# Altium project RobonAUT_Project.PrjPcb
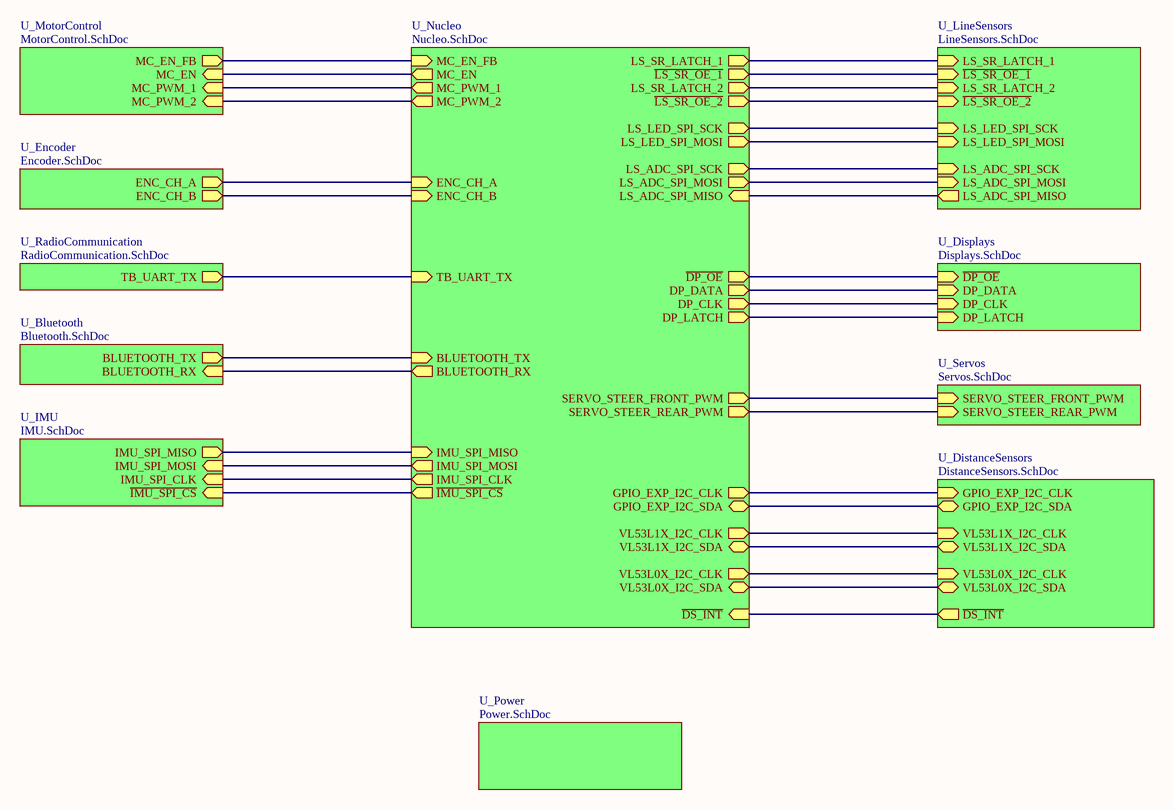
[diagram p0: TopLevel.SchDoc]
14 sheets, 120 parts. Net scope: hierarchical (ports join the sheet entries above them; power ports are global).
Board file: LKBulls2023.PcbDoc
Sheets:
  TopLevel.SchDoc
    U_Nucleo = Nucleo.SchDoc
    U_LineSensors = LineSensors.SchDoc
    U_Displays = Displays.SchDoc
    U_Power = Power.SchDoc
    U_Servos = Servos.SchDoc
    U_DistanceSensors = DistanceSensors.SchDoc
      DS1 = VL53L1X-SATEL.SchDoc
      DS2 = VL53L1X-SATEL.SchDoc
      DS3 = VL53L1X-SATEL.SchDoc
      DS4 = VL53L1X-SATEL.SchDoc
      DS5 = 53L0-SATEL-I1.SchDoc
      DS6 = 53L0-SATEL-I1.SchDoc
      DS7 = 53L0-SATEL-I1.SchDoc
      DS8 = 53L0-SATEL-I1.SchDoc
    U_MotorControl = MotorControl.SchDoc
    U_Encoder = Encoder.SchDoc
    U_RadioCommunication = RadioCommunication.SchDoc
    U_Bluetooth = Bluetooth.SchDoc
    U_IMU = IMU.SchDoc

## Sheet TopLevel.SchDoc: Top Level - Hierarchical View
size A4; Date: 2022 Fall; Address1: LK Bulls; Address2: Bagoly Zoltan; Address3: Feher Daniel; Address4: G. Varga Gabor; DocumentNumber: 1; Revision: 1.0; SheetNumber: 1; SheetTotal: 14

### Sub-sheets
U_Bluetooth = Bluetooth.SchDoc: BLUETOOTH_TX (out), BLUETOOTH_RX (in)
U_Displays = Displays.SchDoc: ~{DP_OE} (in), DP_DATA (in), DP_CLK (in), DP_LATCH (in)
U_DistanceSensors = DistanceSensors.SchDoc: ~{DS_INT} (out), VL53L1X_I2C_CLK (in), VL53L1X_I2C_SDA (bidir), VL53L0X_I2C_CLK (in), VL53L0X_I2C_SDA (bidir), GPIO_EXP_I2C_CLK (in), GPIO_EXP_I2C_SDA (bidir)
U_Encoder = Encoder.SchDoc: ENC_CH_B (out), ENC_CH_A (out)
U_IMU = IMU.SchDoc: IMU_SPI_MISO (out), IMU_SPI_MOSI (in), IMU_SPI_CLK (in), ~{IMU_SPI_CS} (in)
U_LineSensors = LineSensors.SchDoc: LS_LED_SPI_MOSI (in), ~{LS_SR_OE_1} (in), LS_SR_LATCH_1 (in), LS_LED_SPI_SCK (in), LS_SR_LATCH_2 (in), LS_ADC_SPI_MOSI (in), LS_ADC_SPI_MISO (out), LS_ADC_SPI_SCK (in), ~{LS_SR_OE_2} (in)
U_MotorControl = MotorControl.SchDoc: MC_EN_FB (out), MC_EN (in), MC_PWM_1 (in), MC_PWM_2 (in)
U_Nucleo = Nucleo.SchDoc: LS_SR_LATCH_1 (out), LS_SR_LATCH_2 (out), DP_DATA (out), DP_CLK (out), DP_LATCH (out), TB_UART_TX (in), ENC_CH_B (in), ENC_CH_A (in), MC_EN_FB (in), MC_EN (out), MC_PWM_1 (out), MC_PWM_2 (out), SERVO_STEER_FRONT_PWM (out), SERVO_STEER_REAR_PWM (out), BLUETOOTH_TX (in), BLUETOOTH_RX (out), IMU_SPI_MISO (in), IMU_SPI_MOSI (out), IMU_SPI_CLK (out), LS_LED_SPI_MOSI (out), LS_LED_SPI_SCK (out), LS_ADC_SPI_MOSI (out), LS_ADC_SPI_MISO (in), LS_ADC_SPI_SCK (out), ~{IMU_SPI_CS} (out), ~{DP_OE} (out), ~{LS_SR_OE_1} (out), ~{LS_SR_OE_2} (out), ~{DS_INT} (in), VL53L1X_I2C_CLK (out), VL53L1X_I2C_SDA (bidir), VL53L0X_I2C_CLK (out), VL53L0X_I2C_SDA (bidir), GPIO_EXP_I2C_CLK (out), GPIO_EXP_I2C_SDA (bidir)
U_Power = Power.SchDoc: no entries
U_RadioCommunication = RadioCommunication.SchDoc: TB_UART_TX (out)
U_Servos = Servos.SchDoc: SERVO_STEER_FRONT_PWM (in), SERVO_STEER_REAR_PWM (in)

### Nets
NetCN6_DS1_2: sheet U_Nucleo/VL53L1X_I2C_CLK, sheet U_DistanceSensors/VL53L1X_I2C_CLK
NetCN6_DS1_4: sheet U_Nucleo/VL53L1X_I2C_SDA, sheet U_DistanceSensors/VL53L1X_I2C_SDA
NetCN7_DS5_2: sheet U_Nucleo/VL53L0X_I2C_CLK, sheet U_DistanceSensors/VL53L0X_I2C_CLK
NetCN7_DS5_4: sheet U_Nucleo/VL53L0X_I2C_SDA, sheet U_DistanceSensors/VL53L0X_I2C_SDA
NetCN12_4: sheet U_Nucleo/BLUETOOTH_RX, sheet U_Bluetooth/BLUETOOTH_RX
NetR3_2: sheet U_Nucleo/LS_LED_SPI_MOSI, sheet U_LineSensors/LS_LED_SPI_MOSI
NetR4_2: sheet U_Nucleo/LS_LED_SPI_SCK, sheet U_LineSensors/LS_LED_SPI_SCK
NetR5_2: sheet U_Nucleo/LS_ADC_SPI_MOSI, sheet U_LineSensors/LS_ADC_SPI_MOSI
NetR6_2: sheet U_Nucleo/LS_ADC_SPI_MISO, sheet U_LineSensors/LS_ADC_SPI_MISO
NetR7_2: sheet U_Nucleo/LS_ADC_SPI_SCK, sheet U_LineSensors/LS_ADC_SPI_SCK
NetR8_1: sheet U_Nucleo/~{LS_SR_OE_1}, sheet U_LineSensors/~{LS_SR_OE_1}
NetR9_1: sheet U_Nucleo/~{LS_SR_OE_2}, sheet U_LineSensors/~{LS_SR_OE_2}
NetR10_1: sheet U_Nucleo/~{DP_OE}, sheet U_Displays/~{DP_OE}
NetR18_1: sheet U_Nucleo/SERVO_STEER_FRONT_PWM, sheet U_Servos/SERVO_STEER_FRONT_PWM
NetR19_1: sheet U_Nucleo/SERVO_STEER_REAR_PWM, sheet U_Servos/SERVO_STEER_REAR_PWM
NetR20_1: sheet U_Nucleo/GPIO_EXP_I2C_SDA, sheet U_DistanceSensors/GPIO_EXP_I2C_SDA
NetR21_1: sheet U_Nucleo/GPIO_EXP_I2C_CLK, sheet U_DistanceSensors/GPIO_EXP_I2C_CLK
NetR26_1: sheet U_Nucleo/~{DS_INT}, sheet U_DistanceSensors/~{DS_INT}
NetR35_1: sheet U_Nucleo/MC_EN_FB, sheet U_MotorControl/MC_EN_FB
NetR36_1: sheet U_Nucleo/MC_EN, sheet U_MotorControl/MC_EN
NetR37_1: sheet U_Nucleo/MC_PWM_1, sheet U_MotorControl/MC_PWM_1
NetR38_1: sheet U_Nucleo/MC_PWM_2, sheet U_MotorControl/MC_PWM_2
NetR39_1: sheet U_Nucleo/ENC_CH_B, sheet U_Encoder/ENC_CH_B
NetR40_1: sheet U_Nucleo/ENC_CH_A, sheet U_Encoder/ENC_CH_A
NetR41_2: sheet U_Nucleo/TB_UART_TX, sheet U_RadioCommunication/TB_UART_TX
NetR42_1: sheet U_Nucleo/BLUETOOTH_TX, sheet U_Bluetooth/BLUETOOTH_TX
NetR43_2: sheet U_Nucleo/IMU_SPI_MISO, sheet U_IMU/IMU_SPI_MISO
NetU1_1: sheet U_Nucleo/IMU_SPI_CLK, sheet U_IMU/IMU_SPI_CLK
NetU1_17: sheet U_Nucleo/~{IMU_SPI_CS}, sheet U_IMU/~{IMU_SPI_CS}
NetU1_30: sheet U_Nucleo/DP_DATA, sheet U_Displays/DP_DATA
NetU1_34: sheet U_Nucleo/IMU_SPI_MOSI, sheet U_IMU/IMU_SPI_MOSI
NetU1_35: sheet U_Nucleo/DP_LATCH, sheet U_Displays/DP_LATCH
NetU1_37: sheet U_Nucleo/DP_CLK, sheet U_Displays/DP_CLK
NetU1_62: sheet U_Nucleo/LS_SR_LATCH_2, sheet U_LineSensors/LS_SR_LATCH_2
NetU1_72: sheet U_Nucleo/LS_SR_LATCH_1, sheet U_LineSensors/LS_SR_LATCH_1

### Notes on the sheet
- Title
- Size:
- Date:
- A4
- Number:
- Revision:
- Sheet
- of
- Designed by:
- File:

## Sheet Nucleo.SchDoc: Nucleo
size A4; Date: 2022 Fall; Address1: LK Bulls; Address2: Bagoly Zoltan; Address3: Feher Daniel; Address4: G. Varga Gabor; DocumentNumber: 2; Revision: 1.0; SheetNumber: 2; SheetTotal: 14
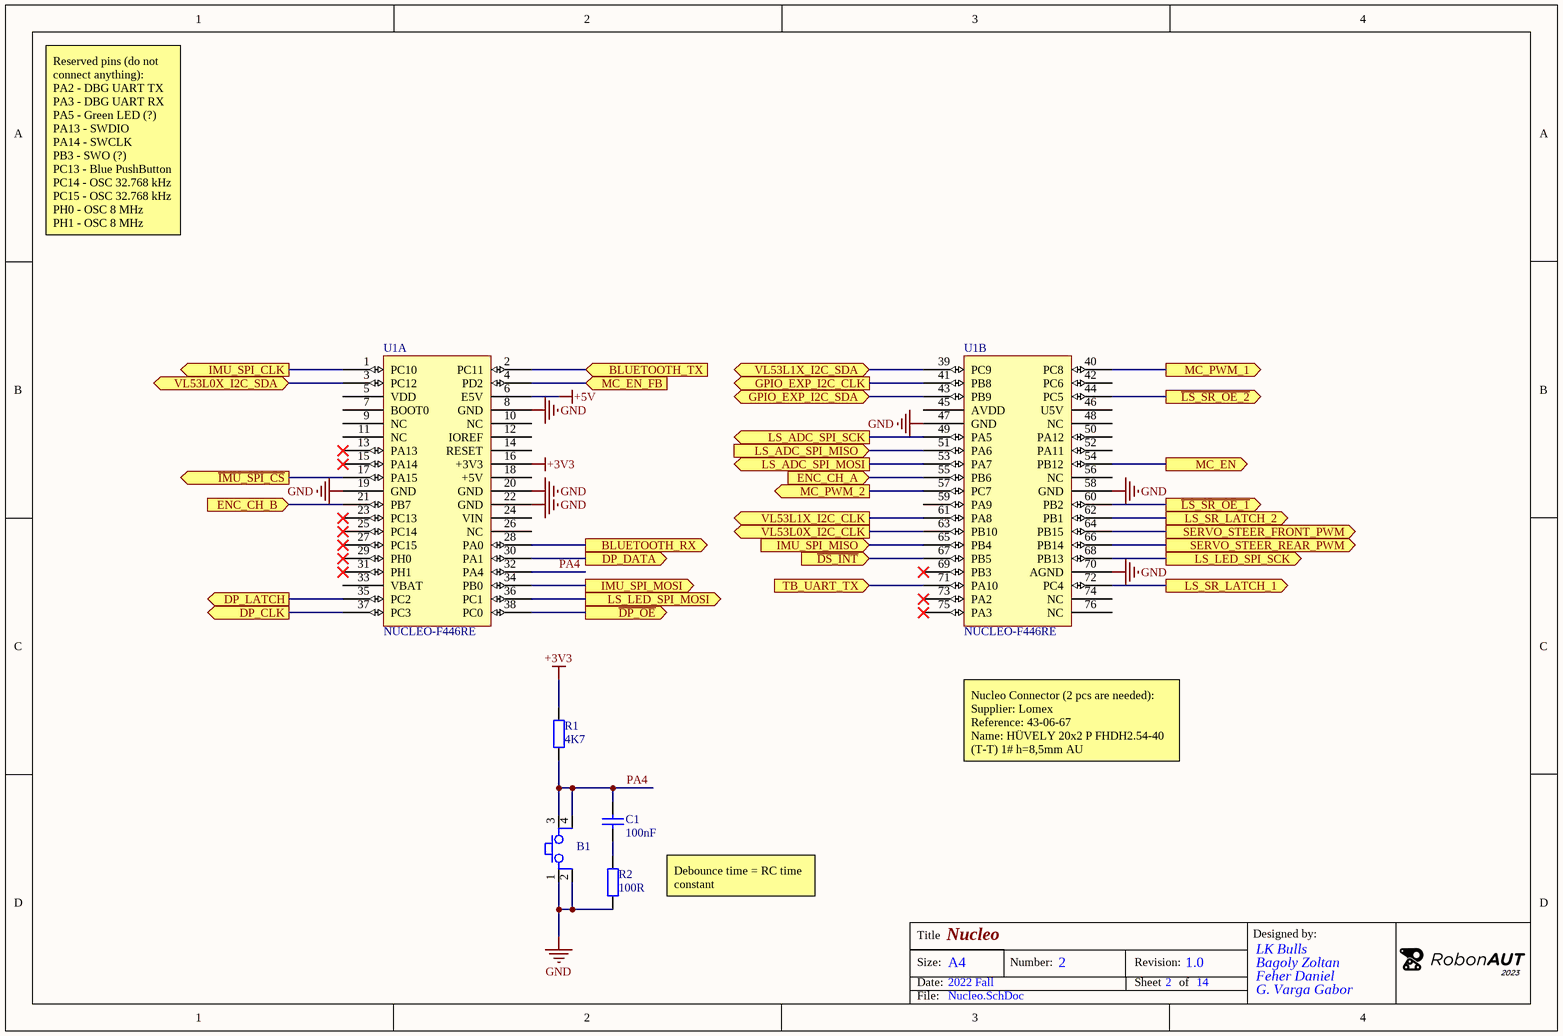
[diagram p1: Nucleo.SchDoc]

### Parts
B1  Button  [FP_BTN_SMD]  (value not drawn)
C1  100nF  [FP_0805_CAP_085]
R1  4K7  [FP_0805_RES]
R2  100R  [FP_0805_RES]
U1  NUCLEO-F446RE  [FP_NUCLEO-64]  (parts A,B of 2)

### Ports
BLUETOOTH_RX (out), BLUETOOTH_TX (in), DP_CLK (out), DP_DATA (out), DP_LATCH (out), ENC_CH_A (in), ENC_CH_B (in), GPIO_EXP_I2C_CLK (out), GPIO_EXP_I2C_SDA (bidir), IMU_SPI_CLK (out), IMU_SPI_MISO (in), IMU_SPI_MOSI (out), LS_ADC_SPI_MISO (in), LS_ADC_SPI_MOSI (out), LS_ADC_SPI_SCK (out), LS_LED_SPI_MOSI (out), LS_LED_SPI_SCK (out), LS_SR_LATCH_1 (out), LS_SR_LATCH_2 (out), MC_EN (out), MC_EN_FB (in), MC_PWM_1 (out), MC_PWM_2 (out), SERVO_STEER_FRONT_PWM (out), SERVO_STEER_REAR_PWM (out), TB_UART_TX (in), VL53L0X_I2C_CLK (out), VL53L0X_I2C_SDA (bidir), VL53L1X_I2C_CLK (out), VL53L1X_I2C_SDA (bidir), ~{DP_OE} (out), ~{DS_INT} (in), ~{IMU_SPI_CS} (out), ~{LS_SR_OE_1} (out), ~{LS_SR_OE_2} (out)

### Nets
+3V3: R1.2 U1.16(+3V3)
+5V: U1.6(E5V)
GND: B1.1 B1.2 R2.2 U1.8(GND) U1.19(GND) U1.20(GND) U1.22(GND) U1.47(GND) U1.58(GND) U1.70(AGND)
PA4: B1.3 B1.4 C1.2 R1.1 U1.32(PA4)
NetC1_1: C1.1 R2.1
NetCN6_DS1_2: U1.61(PA8) ; port VL53L1X_I2C_CLK
NetCN6_DS1_4: U1.39(PC9) ; port VL53L1X_I2C_SDA
NetCN7_DS5_2: U1.63(PB10) ; port VL53L0X_I2C_CLK
NetCN7_DS5_4: U1.3(PC12) ; port VL53L0X_I2C_SDA
NetCN12_4: U1.28(PA0) ; port BLUETOOTH_RX
NetR3_2: U1.36(PC1) ; port LS_LED_SPI_MOSI
NetR4_2: U1.68(PB13) ; port LS_LED_SPI_SCK
NetR5_2: U1.53(PA7) ; port LS_ADC_SPI_MOSI
NetR6_2: U1.51(PA6) ; port LS_ADC_SPI_MISO
NetR7_2: U1.49(PA5) ; port LS_ADC_SPI_SCK
NetR8_1: U1.60(PB2) ; port ~{LS_SR_OE_1}
NetR9_1: U1.44(PC5) ; port ~{LS_SR_OE_2}
NetR10_1: U1.38(PC0) ; port ~{DP_OE}
NetR18_1: U1.64(PB15) ; port SERVO_STEER_FRONT_PWM
NetR19_1: U1.66(PB14) ; port SERVO_STEER_REAR_PWM
NetR20_1: U1.43(PB9) ; port GPIO_EXP_I2C_SDA
NetR21_1: U1.41(PB8) ; port GPIO_EXP_I2C_CLK
NetR26_1: U1.67(PB5) ; port ~{DS_INT}
NetR35_1: U1.4(PD2) ; port MC_EN_FB
NetR36_1: U1.54(PB12) ; port MC_EN
NetR37_1: U1.40(PC8) ; port MC_PWM_1
NetR38_1: U1.57(PC7) ; port MC_PWM_2
NetR39_1: U1.21(PB7) ; port ENC_CH_B
NetR40_1: U1.55(PB6) ; port ENC_CH_A
NetR41_2: U1.71(PA10) ; port TB_UART_TX
NetR42_1: U1.2(PC11) ; port BLUETOOTH_TX
NetR43_2: U1.65(PB4) ; port IMU_SPI_MISO
NetU1_1: U1.1(PC10) ; port IMU_SPI_CLK
NetU1_17: U1.17(PA15) ; port ~{IMU_SPI_CS}
NetU1_30: U1.30(PA1) ; port DP_DATA
NetU1_34: U1.34(PB0) ; port IMU_SPI_MOSI
NetU1_35: U1.35(PC2) ; port DP_LATCH
NetU1_37: U1.37(PC3) ; port DP_CLK
NetU1_62: U1.62(PB1) ; port LS_SR_LATCH_2
NetU1_72: U1.72(PC4) ; port LS_SR_LATCH_1

Not connected (* = marked no-connect by the designer): U1 5(VDD) 7(BOOT0) 9(NC) 10(NC) 11(NC) 12(IOREF) 13(PA13)* 14(RESET) 15(PA14)* 18(+5V) 23(PC13)* 24(VIN) 25(PC14)* 26(NC) 27(PC15)* 29(PH0)* 31(PH1)* 33(VBAT) 42(PC6) 45(AVDD) 46(U5V) 48(NC) 50(PA12) 52(PA11) 56(NC) 59(PA9) 69(PB3)* 73(PA2)* 74(NC) 75(PA3)* 76(NC)

### Notes on the sheet
- Reserved pins (do not connect anything):
  PA2 - DBG UART TX
  PA3 - DBG UART RX
  PA5 - Green LED (?)
  PA13 - SWDIO
  PA14 - SWCLK
  PB3 - SWO (?)
  PC13 - Blue PushButton
  PC14 - OSC 32.768 kHz
  PC15 - OSC 32.768 kHz
  PH0 - OSC 8 MHz
  PH1 - OSC 8 MHz
- Nucleo Connector (2 pcs are needed):
  Supplier: Lomex
  Reference: 43-06-67
  Name: HÜVELY 20x2 P FHDH2.54-40 (T-T) 1# h=8,5mm AU
- Debounce time = RC time constant
- Title
- Size:
- Date:
- A4
- Number:
- Revision:
- Sheet
- of
- Designed by:
- File:

### Library data of the parts
B1 = Button 4P: Push button; Reference: 100.224.61; Name: TACT-64N-F, Nyomógomb, mikrokapcsoló TACT, SPST-NO, THT, 4.3mm, 6x6mm; Supplier: Hestore
C1 = CAP: Capacitor; Tolerance: 10%; Voltage: 50V; Name: 100nF 0805 10% 50V X7R 0805B104K500NT (FNG); Supplier: Lomex; Reference: 82-13-46; Value: 100nF
R1 = RES: Resistor; Tolerance: 5%; Power: 0.125W; Name: 4K70 0805 5% CR-05JL7---4K7 0.125W (VIK); Supplier: Lomex; Reference: 81-10-95; Value: 4K7
R2 = RES: Resistor; Tolerance: 5%; Power: 0.125W; Name: 100R 0805 5% RC0805JR-10100RL 0.125W (YAG; Supplier: Lomex; Reference: 81-34-71; Value: 100R
U1 = NUCLEO-F446RE: Reference: NUCLEO; Name: Nucleo F446RE; Supplier: Tanszék

## Sheet LineSensors.SchDoc: Line Sensors
size A4; Date: 2022 Fall; Address1: LK Bulls; Address2: Bagoly Zoltan; Address3: Feher Daniel; Address4: G. Varga Gabor; DocumentNumber: 3; Revision: 1.0; SheetNumber: 3; SheetTotal: 14
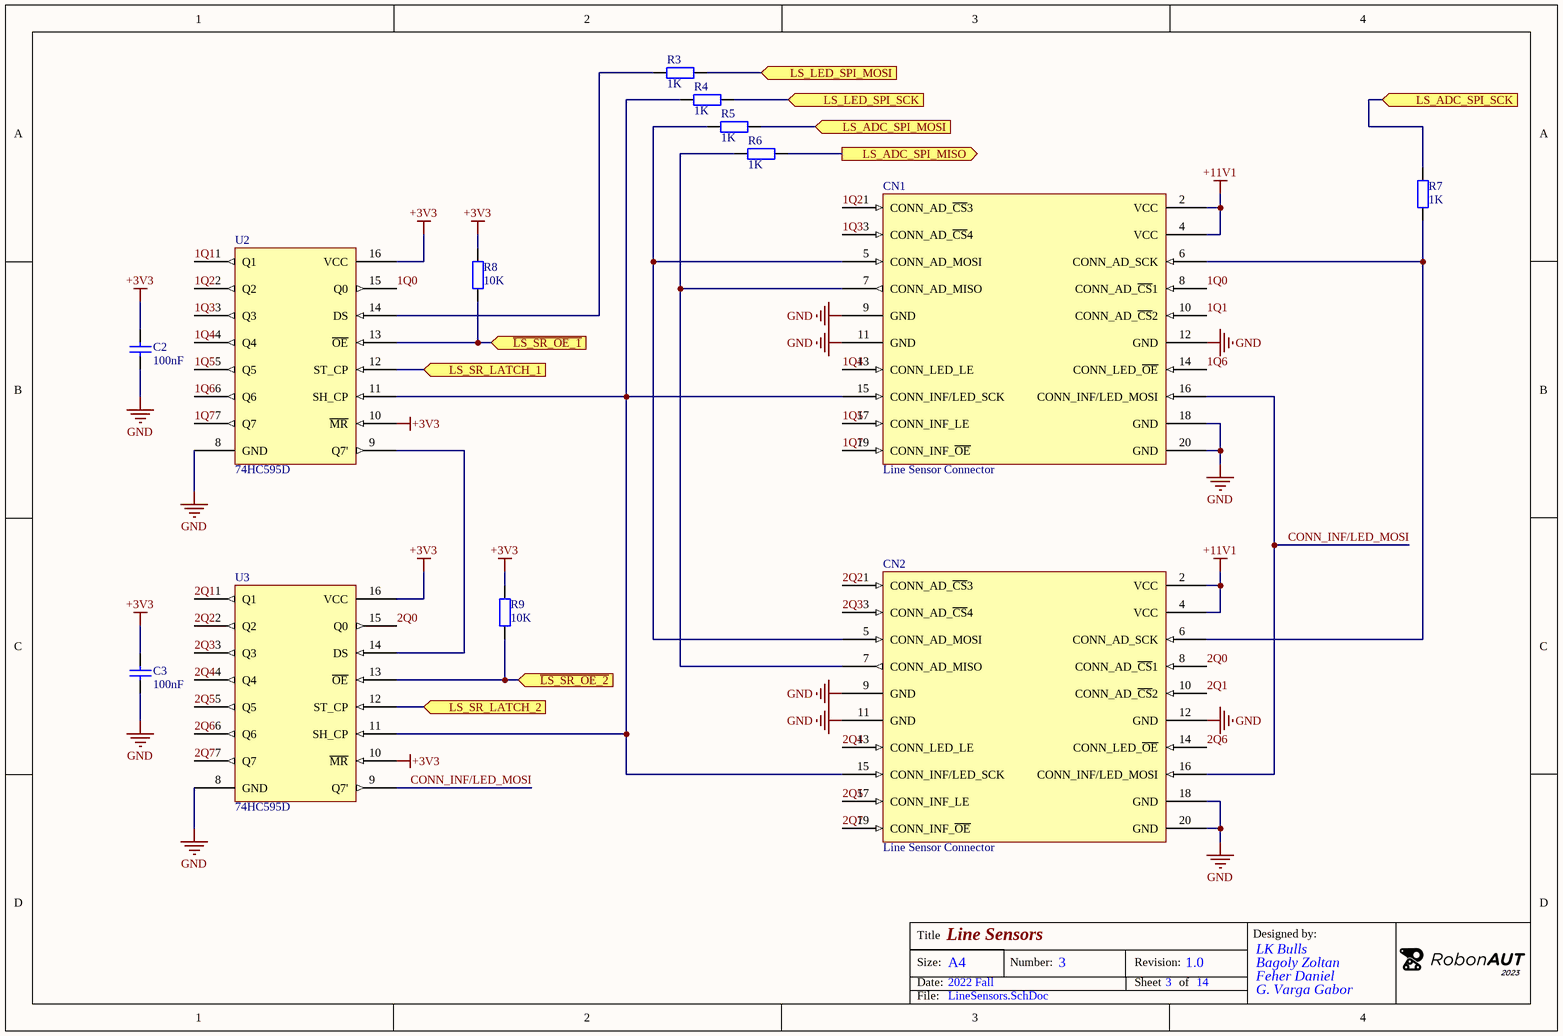
[diagram p2: LineSensors.SchDoc]

### Parts
C2  100nF  [FP_0805_CAP_085]
C3  100nF  [FP_0805_CAP_085]
CN1  Line Sensor Connector  [CONNECTOR-20P]
CN2  Line Sensor Connector  [CONNECTOR-20P]
R3  1K  [FP_0805_RES]
R4  1K  [FP_0805_RES]
R5  1K  [FP_0805_RES]
R6  1K  [FP_0805_RES]
R7  1K  [FP_0805_RES]
R8  10K  [FP_0805_RES]
R9  10K  [FP_0805_RES]
U2  74HC595D  [SO16]
U3  74HC595D  [SO16]

### Ports
LS_ADC_SPI_MISO (out), LS_ADC_SPI_MOSI (in), LS_ADC_SPI_SCK (in), LS_LED_SPI_MOSI (in), LS_LED_SPI_SCK (in), LS_SR_LATCH_1 (in), LS_SR_LATCH_2 (in), ~{LS_SR_OE_1} (in), ~{LS_SR_OE_2} (in)

### Nets
+3V3: C2.2 C3.2 R8.2 R9.2 U2.10(~{MR}) U2.16(VCC) U3.10(~{MR}) U3.16(VCC)
+11V1: CN1.2(VCC) CN1.4(VCC) CN2.2(VCC) CN2.4(VCC)
GND: C2.1 C3.1 CN1.9(GND) CN1.11(GND) CN1.12(GND) CN1.18(GND) CN1.20(GND) CN2.9(GND) CN2.11(GND) CN2.12(GND) CN2.18(GND) CN2.20(GND) U2.8(GND) U3.8(GND)
1Q0: CN1.8(CONN_AD_~{CS}1) U2.15(Q0)
1Q1: CN1.10(CONN_AD_~{CS}2) U2.1(Q1)
1Q2: CN1.1(CONN_AD_~{CS}3) U2.2(Q2)
1Q3: CN1.3(CONN_AD_~{CS}4) U2.3(Q3)
1Q4: CN1.13(CONN_LED_LE) U2.4(Q4)
1Q5: CN1.17(CONN_INF_LE) U2.5(Q5)
1Q6: CN1.14(CONN_LED_~{OE}) U2.6(Q6)
1Q7: CN1.19(CONN_INF_~{OE}) U2.7(Q7)
2Q0: CN2.8(CONN_AD_~{CS}1) U3.15(Q0)
2Q1: CN2.10(CONN_AD_~{CS}2) U3.1(Q1)
2Q2: CN2.1(CONN_AD_~{CS}3) U3.2(Q2)
2Q3: CN2.3(CONN_AD_~{CS}4) U3.3(Q3)
2Q4: CN2.13(CONN_LED_LE) U3.4(Q4)
2Q5: CN2.17(CONN_INF_LE) U3.5(Q5)
2Q6: CN2.14(CONN_LED_~{OE}) U3.6(Q6)
2Q7: CN2.19(CONN_INF_~{OE}) U3.7(Q7)
CONN_INF/LED_MOSI: CN1.16(CONN_INF/LED_MOSI) CN2.16(CONN_INF/LED_MOSI) U3.9(Q7')
NetCN1_5: CN1.5(CONN_AD_MOSI) CN2.5(CONN_AD_MOSI) R5.1
NetCN1_6: CN1.6(CONN_AD_SCK) CN2.6(CONN_AD_SCK) R7.1
NetCN1_7: CN1.7(CONN_AD_MISO) CN2.7(CONN_AD_MISO) R6.1
NetCN1_15: CN1.15(CONN_INF/LED_SCK) CN2.15(CONN_INF/LED_SCK) R4.1 U2.11(SH_CP) U3.11(SH_CP)
NetR3_1: R3.1 U2.14(DS)
NetR3_2: R3.2 ; port LS_LED_SPI_MOSI
NetR4_2: R4.2 ; port LS_LED_SPI_SCK
NetR5_2: R5.2 ; port LS_ADC_SPI_MOSI
NetR6_2: R6.2 ; port LS_ADC_SPI_MISO
NetR7_2: R7.2 ; port LS_ADC_SPI_SCK
NetR8_1: R8.1 U2.13(~{OE}) ; port ~{LS_SR_OE_1}
NetR9_1: R9.1 U3.13(~{OE}) ; port ~{LS_SR_OE_2}
NetU1_62: U3.12(ST_CP) ; port LS_SR_LATCH_2
NetU1_72: U2.12(ST_CP) ; port LS_SR_LATCH_1
NetU2_9: U2.9(Q7') U3.14(DS)

### Notes on the sheet
- Title
- Size:
- Date:
- A4
- Number:
- Revision:
- Sheet
- of
- Designed by:
- File:

### Library data of the parts
C2 C3 = CAP: as C1 on sheet Nucleo; Supplier: Lomex; Reference: 82-13-46; Value: 100nF
CN1 CN2 = Connector_Line_Sensor: Name: SZAL.KABEL 20 P APA 90° BHR-20 (T-T); Supplier: Lomex; Reference: 43-01-11
R3-R7 = RES: Resistor; Tolerance: 5%; Power: 0.125W; Name: 1K00 0805 5% CR-05JL7----1K 0.125W (VIK); Supplier: Lomex; Reference: 81-10-87; Value: 1K
R8 R9 = RES: Resistor; Tolerance: 5%; Power: 0.125W; Name: 10K0 0805 5% CR-05JL7---10K 0.125W (VIK); Supplier: Lomex; Reference: 81-10-99; Value: 10K
U2 U3 = 74HC595D: 8-bit serial-in, serial or parallel-out shift register with output latches; 3-state; Name: 74HC595D,118 (NXP) 8-BIT SHIFT-REGISTER WITH OUTPUT LATCH SO-16; Supplier: Lomex; Reference: 87-01-20

## Sheet Displays.SchDoc: Displays
size A4; Date: 2022 Fall; Address1: LK Bulls; Address2: Bagoly Zoltan; Address3: Feher Daniel; Address4: G. Varga Gabor; DocumentNumber: 4; Revision: 1.0; SheetNumber: 4; SheetTotal: 14
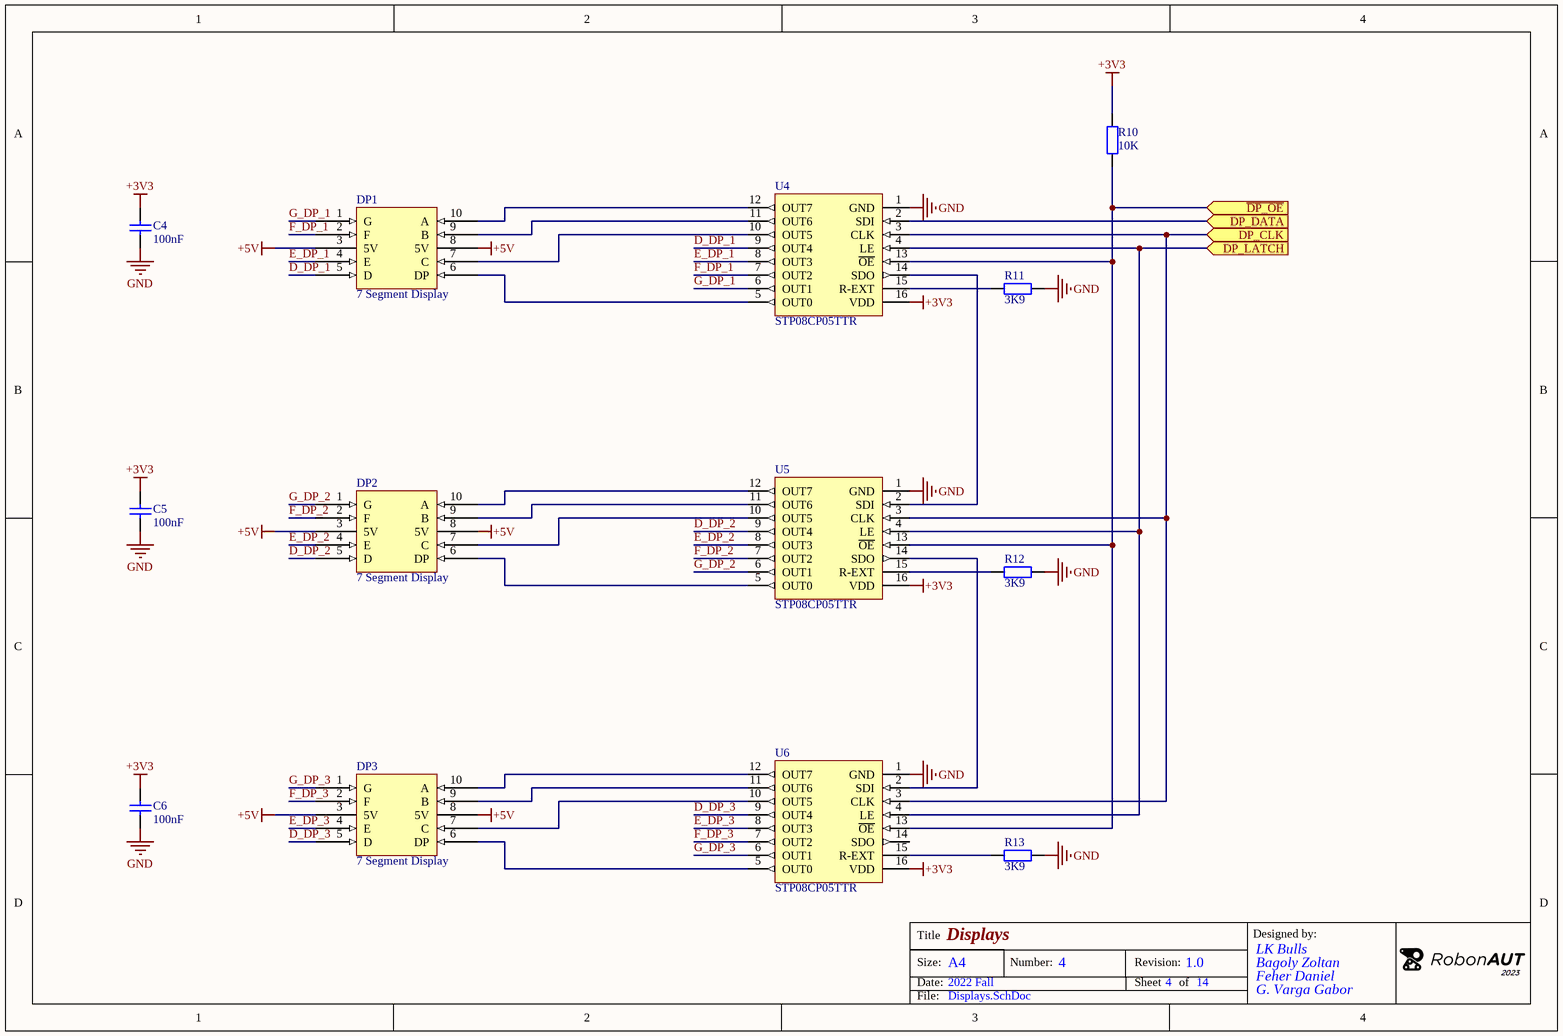
[diagram p3: Displays.SchDoc]

### Parts
C4  100nF  [FP_0805_CAP_085]
C5  100nF  [FP_0805_CAP_085]
C6  100nF  [FP_0805_CAP_085]
DP1  7 Segment Display  [FP_7_Segment_Display]
DP2  7 Segment Display  [FP_7_Segment_Display]
DP3  7 Segment Display  [FP_7_Segment_Display]
R10  10K  [FP_0805_RES]
R11  3K9  [FP_0805_RES]
R12  3K9  [FP_0805_RES]
R13  3K9  [FP_0805_RES]
U4  STP08CP05TTR  [SOP127P600-sajat_0095-015]
U5  STP08CP05TTR  [SOP127P600-sajat_0095-015]
U6  STP08CP05TTR  [SOP127P600-sajat_0095-015]

### Ports
DP_CLK (in), DP_DATA (in), DP_LATCH (in), ~{DP_OE} (in)

### Nets
+3V3: C4.2 C5.2 C6.2 R10.2 U4.16(VDD) U5.16(VDD) U6.16(VDD)
+5V: DP1.3(5V) DP1.8(5V) DP2.3(5V) DP2.8(5V) DP3.3(5V) DP3.8(5V)
GND: C4.1 C5.1 C6.1 R11.2 R12.2 R13.2 U4.1(GND) U5.1(GND) U6.1(GND)
D_DP_1: DP1.5(D) U4.9(OUT4)
D_DP_2: DP2.5(D) U5.9(OUT4)
D_DP_3: DP3.5(D) U6.9(OUT4)
E_DP_1: DP1.4(E) U4.8(OUT3)
E_DP_2: DP2.4(E) U5.8(OUT3)
E_DP_3: DP3.4(E) U6.8(OUT3)
F_DP_1: DP1.2(F) U4.7(OUT2)
F_DP_2: DP2.2(F) U5.7(OUT2)
F_DP_3: DP3.2(F) U6.7(OUT2)
G_DP_1: DP1.1(G) U4.6(OUT1)
G_DP_2: DP2.1(G) U5.6(OUT1)
G_DP_3: DP3.1(G) U6.6(OUT1)
NetDP1_6: DP1.6(DP) U4.5(OUT0)
NetDP1_7: DP1.7(C) U4.10(OUT5)
NetDP1_9: DP1.9(B) U4.11(OUT6)
NetDP1_10: DP1.10(A) U4.12(OUT7)
NetDP2_6: DP2.6(DP) U5.5(OUT0)
NetDP2_7: DP2.7(C) U5.10(OUT5)
NetDP2_9: DP2.9(B) U5.11(OUT6)
NetDP2_10: DP2.10(A) U5.12(OUT7)
NetDP3_6: DP3.6(DP) U6.5(OUT0)
NetDP3_7: DP3.7(C) U6.10(OUT5)
NetDP3_9: DP3.9(B) U6.11(OUT6)
NetDP3_10: DP3.10(A) U6.12(OUT7)
NetR10_1: R10.1 U4.13(~{OE}) U5.13(~{OE}) U6.13(~{OE}) ; port ~{DP_OE}
NetR11_1: R11.1 U4.15(R-EXT)
NetR12_1: R12.1 U5.15(R-EXT)
NetR13_1: R13.1 U6.15(R-EXT)
NetU1_30: U4.2(SDI) ; port DP_DATA
NetU1_35: U4.4(LE) U5.4(LE) U6.4(LE) ; port DP_LATCH
NetU1_37: U4.3(CLK) U5.3(CLK) U6.3(CLK) ; port DP_CLK
NetU4_14: U4.14(SDO) U5.2(SDI)
NetU5_14: U5.14(SDO) U6.2(SDI)

Not connected (* = marked no-connect by the designer): U6 14(SDO)

### Notes on the sheet
- Title
- Size:
- Date:
- A4
- Number:
- Revision:
- Sheet
- of
- Designed by:
- File:

### Library data of the parts
C4-C6 = CAP: as C1 on sheet Nucleo; Supplier: Lomex; Reference: 82-13-46; Value: 100nF
DP1-DP3 = 7_Segment_Display: Name: FYS-3911BUHR-21 (FYL) 7 SEG SRED COM.AN. 10mm 30mcd 10x13x7mm 640nm; Supplier: Lomex; Reference: 35-03-94
R10 = RES: as R8 on sheet LineSensors; Supplier: Lomex; Reference: 81-10-99; Value: 10K
R11-R13 = RES: Resistor; Tolerance: 5%; Power: 0.125W; Name: 3K90 0805 5% CR-05JL7---3K9 0.125W (VIK); Supplier: Lomex; Reference: 81-10-94; Value: 3K9
U4-U6 = STP08CP05TTR: Low voltage, low current power 8-bit shift register; Reference: Tanszék; Name: STP08CP05TTR, Counter Shift Registers Lo Vltg LoCurent Pwr 8B shift register; Supplier: Tanszék

## Sheet Power.SchDoc: Power
size A4; Date: 2022 Fall; Address1: LK Bulls; Address2: Bagoly Zoltan; Address3: Feher Daniel; Address4: G. Varga Gabor; DocumentNumber: 5; Revision: 1.0; SheetNumber: 5; SheetTotal: 14
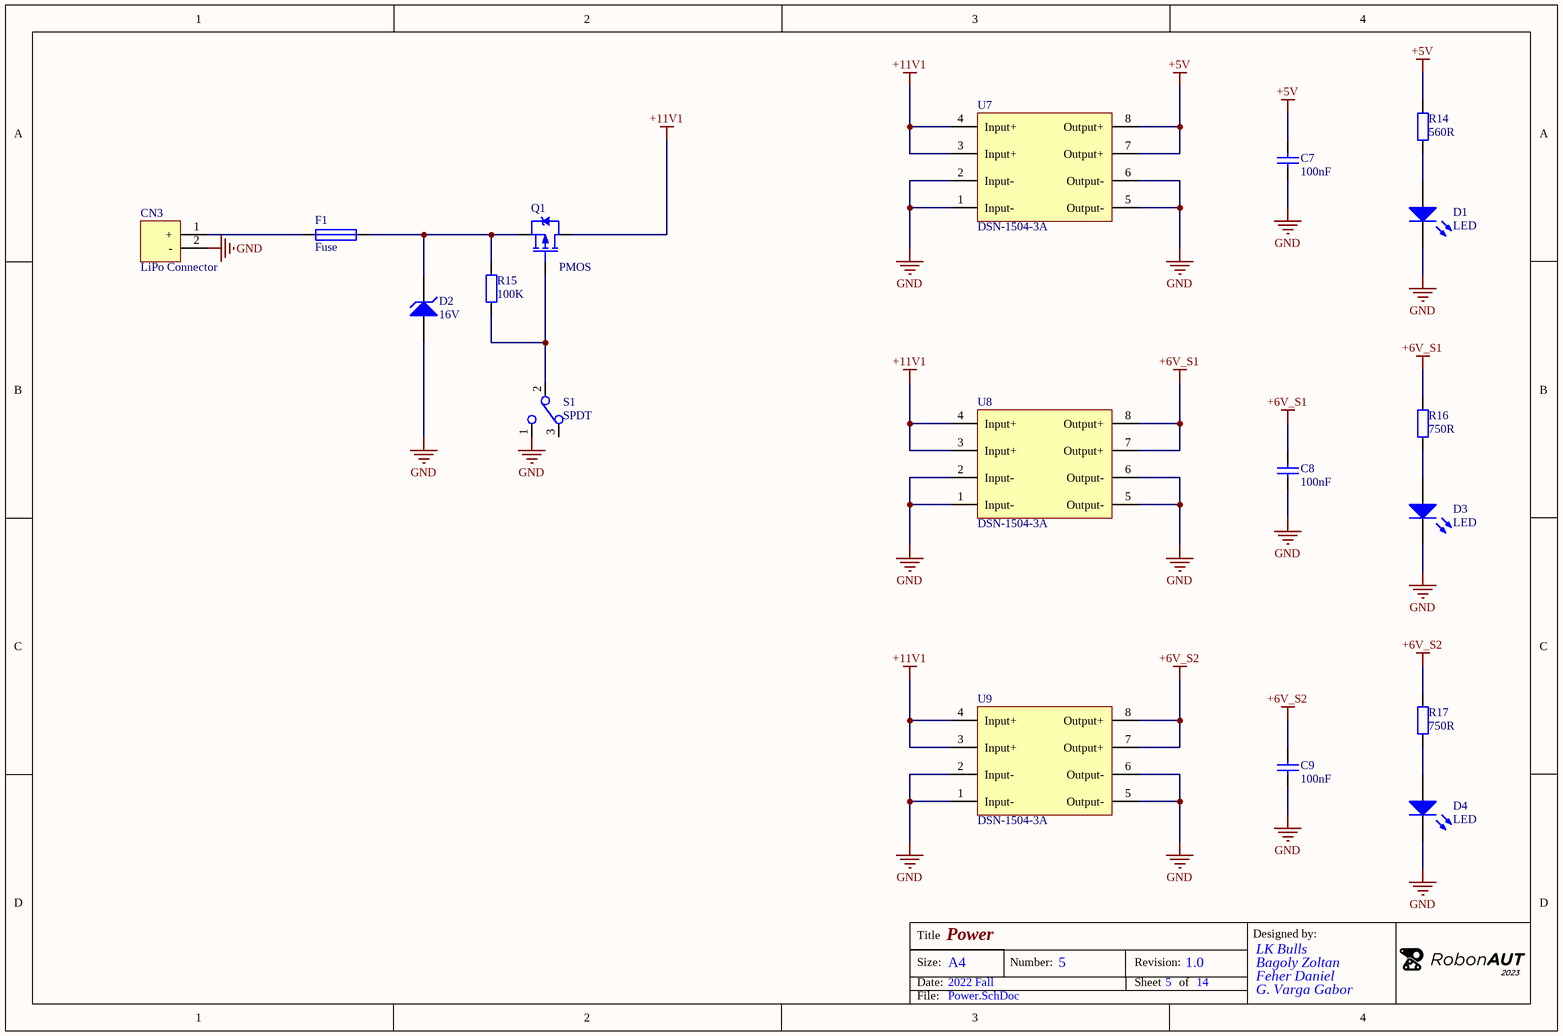
[diagram p4: Power.SchDoc]

### Parts
C7  100nF  [FP_0805_CAP_085]
C8  100nF  [FP_0805_CAP_085]
C9  100nF  [FP_0805_CAP_085]
CN3  LiPo Connector  [FP_BATTERY]
D1  LED  [FP_0805_LED_GREEN]
D2  16V  [FP_SOD-123]
D3  LED  [FP_0805_LED_GREEN]
D4  LED  [FP_0805_LED_GREEN]
F1  Fuse  [FP_CONN2_TUSKE_254MM]
Q1  PMOS  [FP_DPAK-TO252]
R14  560R  [FP_0805_RES]
R15  100K  [FP_0805_RES]
R16  750R  [FP_0805_RES]
R17  750R  [FP_0805_RES]
S1  SPDT  [FP_SPDT]
U7  DSN-1504-3A  [FP_DCDC_DSN]
U8  DSN-1504-3A  [FP_DCDC_DSN]
U9  DSN-1504-3A  [FP_DCDC_DSN]

### Nets
+5V: C7.2 R14.2 U7.7(Output+) U7.8(Output+)
+6V_S1: C8.2 R16.2 U8.7(Output+) U8.8(Output+)
+6V_S2: C9.2 R17.2 U9.7(Output+) U9.8(Output+)
+11V1: Q1.2(D) U7.3(Input+) U7.4(Input+) U8.3(Input+) U8.4(Input+) U9.3(Input+) U9.4(Input+)
GND: C7.1 C8.1 C9.1 CN3.2(-) D1.2(K) D2.A D3.2(K) D4.2(K) S1.1(C1) U7.1(Input-) U7.2(Input-) U7.5(Output-) U7.6(Output-) U8.1(Input-) U8.2(Input-) U8.5(Output-) U8.6(Output-) U9.1(Input-) U9.2(Input-) U9.5(Output-) U9.6(Output-)
NetCN3_1: CN3.1(+) F1.1
NetD1_1: D1.1(A) R14.1
NetD2_K: D2.K F1.2 Q1.3(S) R15.2
NetD3_1: D3.1(A) R16.1
NetD4_1: D4.1(A) R17.1
NetQ1_1: Q1.1(G) R15.1 S1.2(C2)

Not connected (* = marked no-connect by the designer): S1 3(C3)

### Notes on the sheet
- Title
- Size:
- Date:
- A4
- Number:
- Revision:
- Sheet
- of
- Designed by:
- File:

### Library data of the parts
C7-C9 = CAP: as C1 on sheet Nucleo; Supplier: Lomex; Reference: 82-13-46; Value: 100nF
CN3 = Connector_LiPo: LiPo Battery Connector; Reference: FD-W115M; Name: XT60 + CAP Apa; Supplier: https://shop.modell.hu/kabel-amass-xt60-cap-apa-csatlakozoval-szerelve
D1 D3 D4 = LED: Typical RED GaAs LED; pin to pad: 1>A 2>K; Name: 2012 GREEN 568nm 70mcd KP-2012MGC (KIN) W.CLEAR 2x1.2x1.1mm 0805 120°; Supplier: Lomex; Reference: 95-00-57
D2 = ZENER: Zener Diode; Name: 16V 0.5W SMSZ1600-35 (MOT) MMSZ5246BT1 SOD-123 ˝J1˝; Supplier: Lomex; U_Z: 16V; Reference: 85-00-88
F1 = Fuse: Name: 6A 30V 30R600UF POLYFUSE 16.5x16.5mm (LFS); Reference: 44-03-11; Supplier: Lomex
Q1 = PMOS: MOSFET, P CH; Name: IRFR9024NTRPBF (INF) P-POWERFET 55V 11A 38W Rds<0.175R DPAK; Supplier: Lomex; Reference: 86-01-67
R14 = RES: Resistor; Tolerance: 5%; Power: 0.125W; Name: 560R 0805 5% CR-05JL7--560R 0.125W (VIK); Supplier: Lomex; Reference: 81-10-84; Value: 560R
R15 = RES: Resistor; Tolerance: 5%; Power: 0.125W; Name: 100K 0805 5% CR-05JL7--100K 0.125W (VIK); Supplier: Lomex; Reference: 81-11-11; Value: 100K
R16 R17 = RES: Resistor; Tolerance: 5%; Power: 0.125W; Name: 750R 0805 5% CR-05JL7--750R 0.125W (VIK); Supplier: Lomex; Reference: 81-12-65; Value: 750R
S1 = SPDT Switch: Single-Pole, Double-Throw Switch; Reference: 100.264.66; Name: TSSM-1022-A2, Kapcsoló, nyelves, 1A/250V AC, M5, SPDT, ON-ON; Supplier: Hestore
U7-U9 = DSN-1504-3A: Switched-Mode Power Supply (SMPS), Step Down (Synchronous Buck) voltage regulator, Input 4.5-28V, Output 0.8-20V, 3A; Reference: 100.381.18; Name: DSN-1504-3A, Kapcsolóüzemű step-down feszültségszabályzó, 4.5-28V/0.8-20V, 3A; Supplier: Hestore

## Sheet Servos.SchDoc: Servos
size A4; Date: 2022 Fall; Address1: LK Bulls; Address2: Bagoly Zoltan; Address3: Feher Daniel; Address4: G. Varga Gabor; DocumentNumber: 6; Revision: 1.0; SheetNumber: 6; SheetTotal: 14
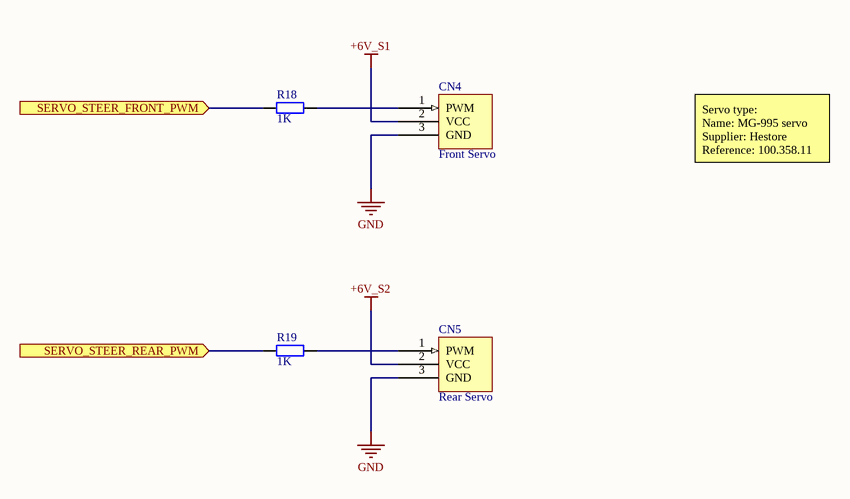
[diagram p5: Servos.SchDoc]

### Parts
CN4  Front Servo  [FP_CONN3_TUSKE_254MM]
CN5  Rear Servo  [FP_CONN3_TUSKE_254MM]
R18  1K  [FP_0805_RES]
R19  1K  [FP_0805_RES]

### Ports
SERVO_STEER_FRONT_PWM (in), SERVO_STEER_REAR_PWM (in)

### Nets
+6V_S1: CN4.2(VCC)
+6V_S2: CN5.2(VCC)
GND: CN4.3(GND) CN5.3(GND)
NetCN4_1: CN4.1(PWM) R18.2
NetCN5_1: CN5.1(PWM) R19.2
NetR18_1: R18.1 ; port SERVO_STEER_FRONT_PWM
NetR19_1: R19.1 ; port SERVO_STEER_REAR_PWM

### Notes on the sheet
- Servo type:
  Name: MG-995 servo
  Supplier: Hestore
  Reference: 100.358.11
- Title
- Size:
- Date:
- A4
- Number:
- Revision:
- Sheet
- of
- Designed by:
- File:

### Library data of the parts
CN4 CN5 = Connector_servo: Steering servo / MG-995 servo; Name: TÜSKESOR 40 P PHSS-40- 6/3 (T-T) 2.54mm PIN 0.64x0.64 TÖRDELHETÖ; Supplier: Lomex; Reference: 43-00-73
R18 R19 = RES: as R3 on sheet LineSensors; Supplier: Lomex; Reference: 81-10-87; Value: 1K

## Sheet DistanceSensors.SchDoc: Distance Sensors
size A4; Date: 2022 Fall; Address1: LK Bulls; Address2: Bagoly Zoltan; Address3: Feher Daniel; Address4: G. Varga Gabor; DocumentNumber: 7; Revision: 1.0; SheetNumber: 7; SheetTotal: 14
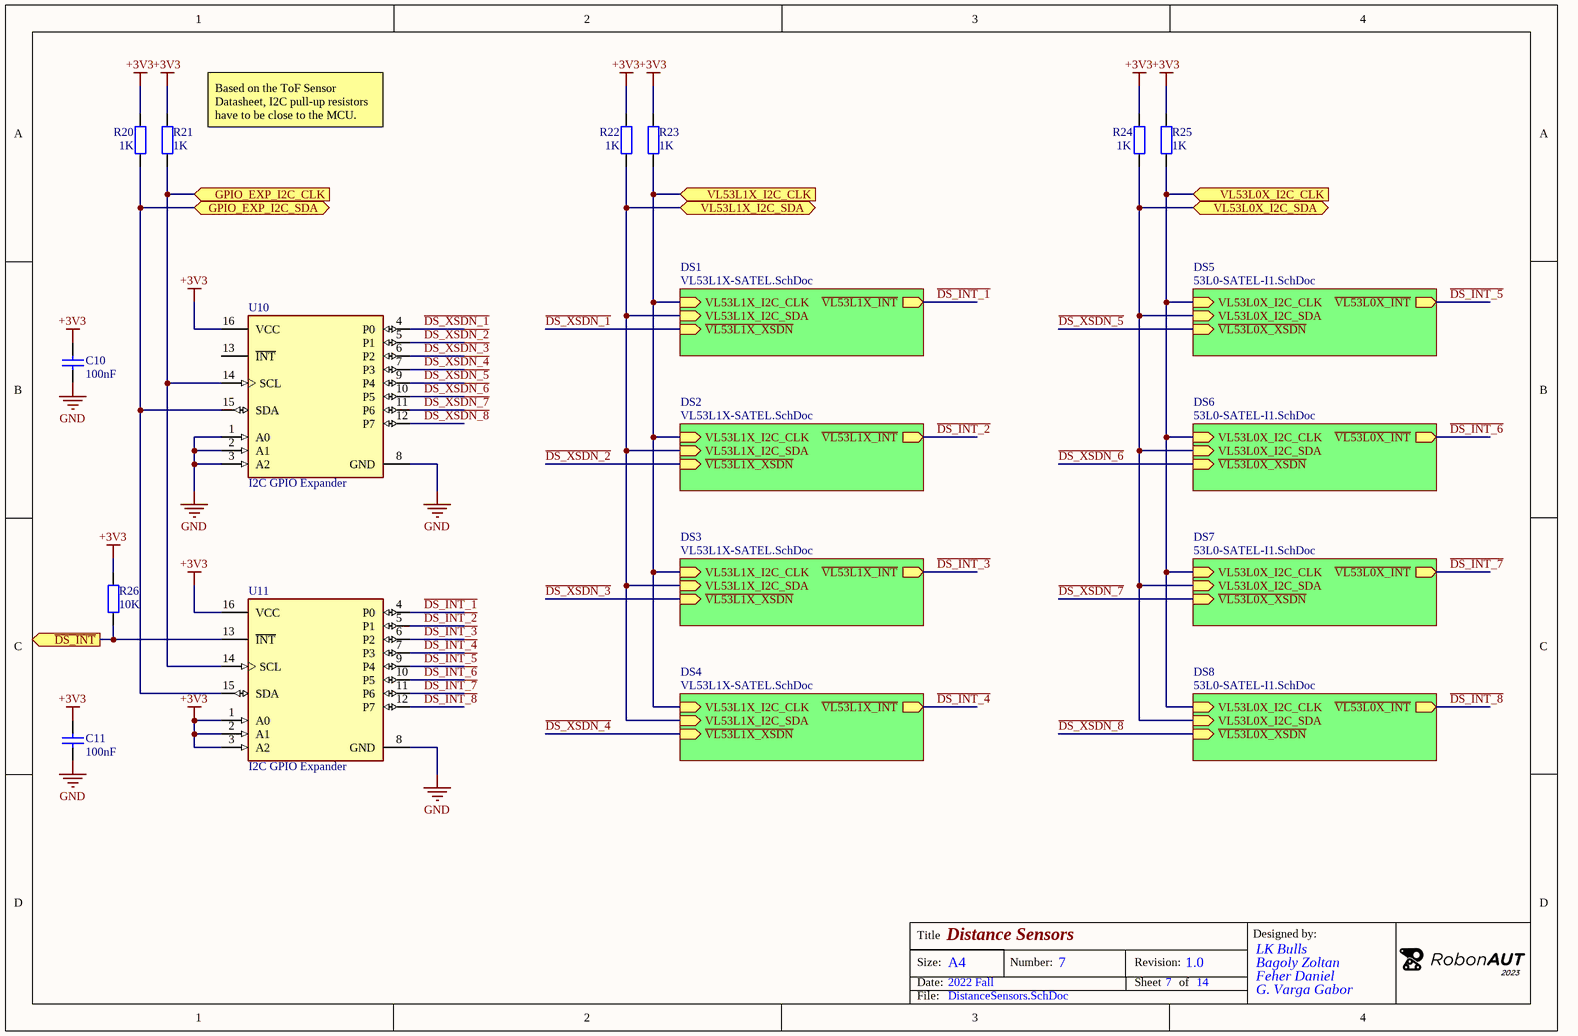
[diagram p6: DistanceSensors.SchDoc]

### Parts
C10  100nF  [FP_0805_CAP_085]
C11  100nF  [FP_0805_CAP_085]
R20  1K  [FP_0805_RES]
R21  1K  [FP_0805_RES]
R22  1K  [FP_0805_RES]
R23  1K  [FP_0805_RES]
R24  1K  [FP_0805_RES]
R25  1K  [FP_0805_RES]
R26  10K  [FP_0805_RES]
U10  I2C GPIO Expander  [FP_TCA9534PWR]
U11  I2C GPIO Expander  [FP_TCA9534PWR]

### Sub-sheets
DS1 = VL53L1X-SATEL.SchDoc: VL53L1X_I2C_CLK (in), ~{VL53L1X_XSDN} (in), VL53L1X_I2C_SDA (in), ~{VL53L1X_INT} (out)
DS2 = VL53L1X-SATEL.SchDoc: VL53L1X_I2C_CLK (in), ~{VL53L1X_XSDN} (in), VL53L1X_I2C_SDA (in), ~{VL53L1X_INT} (out)
DS3 = VL53L1X-SATEL.SchDoc: VL53L1X_I2C_CLK (in), ~{VL53L1X_XSDN} (in), VL53L1X_I2C_SDA (in), ~{VL53L1X_INT} (out)
DS4 = VL53L1X-SATEL.SchDoc: VL53L1X_I2C_CLK (in), ~{VL53L1X_XSDN} (in), VL53L1X_I2C_SDA (in), ~{VL53L1X_INT} (out)
DS5 = 53L0-SATEL-I1.SchDoc: VL53L0X_I2C_CLK (in), ~{VL53L0X_XSDN} (in), VL53L0X_I2C_SDA (in), ~{VL53L0X_INT} (out)
DS6 = 53L0-SATEL-I1.SchDoc: VL53L0X_I2C_CLK (in), ~{VL53L0X_XSDN} (in), VL53L0X_I2C_SDA (in), ~{VL53L0X_INT} (out)
DS7 = 53L0-SATEL-I1.SchDoc: VL53L0X_I2C_CLK (in), ~{VL53L0X_XSDN} (in), VL53L0X_I2C_SDA (in), ~{VL53L0X_INT} (out)
DS8 = 53L0-SATEL-I1.SchDoc: VL53L0X_I2C_CLK (in), ~{VL53L0X_XSDN} (in), VL53L0X_I2C_SDA (in), ~{VL53L0X_INT} (out)

### Ports
GPIO_EXP_I2C_CLK (in), GPIO_EXP_I2C_SDA (bidir), VL53L0X_I2C_CLK (in), VL53L0X_I2C_SDA (bidir), VL53L1X_I2C_CLK (in), VL53L1X_I2C_SDA (bidir), ~{DS_INT} (out)

### Nets
+3V3: C10.2 C11.2 R20.2 R21.2 R22.2 R23.2 R24.2 R25.2 R26.2 U10.16(VCC) U11.1(A0) U11.2(A1) U11.3(A2) U11.16(VCC)
GND: C10.1 C11.1 U10.1(A0) U10.2(A1) U10.3(A2) U10.8(GND) U11.8(GND)
~{DS_INT_1}: U11.4(P0) ; sheet DS1/~{VL53L1X_INT}
~{DS_INT_2}: U11.5(P1) ; sheet DS2/~{VL53L1X_INT}
~{DS_INT_3}: U11.6(P2) ; sheet DS3/~{VL53L1X_INT}
~{DS_INT_4}: U11.7(P3) ; sheet DS4/~{VL53L1X_INT}
~{DS_INT_5}: U11.9(P4) ; sheet DS5/~{VL53L0X_INT}
~{DS_INT_6}: U11.10(P5) ; sheet DS6/~{VL53L0X_INT}
~{DS_INT_7}: U11.11(P6) ; sheet DS7/~{VL53L0X_INT}
~{DS_INT_8}: U11.12(P7) ; sheet DS8/~{VL53L0X_INT}
~{DS_XSDN_1}: U10.4(P0) ; sheet DS1/~{VL53L1X_XSDN}
~{DS_XSDN_2}: U10.5(P1) ; sheet DS2/~{VL53L1X_XSDN}
~{DS_XSDN_3}: U10.6(P2) ; sheet DS3/~{VL53L1X_XSDN}
~{DS_XSDN_4}: U10.7(P3) ; sheet DS4/~{VL53L1X_XSDN}
~{DS_XSDN_5}: U10.9(P4) ; sheet DS5/~{VL53L0X_XSDN}
~{DS_XSDN_6}: U10.10(P5) ; sheet DS6/~{VL53L0X_XSDN}
~{DS_XSDN_7}: U10.11(P6) ; sheet DS7/~{VL53L0X_XSDN}
~{DS_XSDN_8}: U10.12(P7) ; sheet DS8/~{VL53L0X_XSDN}
NetCN6_DS1_2: R23.1 ; port VL53L1X_I2C_CLK, sheet DS1/VL53L1X_I2C_CLK, sheet DS2/VL53L1X_I2C_CLK, sheet DS3/VL53L1X_I2C_CLK, sheet DS4/VL53L1X_I2C_CLK
NetCN6_DS1_4: R22.1 ; port VL53L1X_I2C_SDA, sheet DS1/VL53L1X_I2C_SDA, sheet DS2/VL53L1X_I2C_SDA, sheet DS3/VL53L1X_I2C_SDA, sheet DS4/VL53L1X_I2C_SDA
NetCN7_DS5_2: R25.1 ; port VL53L0X_I2C_CLK, sheet DS5/VL53L0X_I2C_CLK, sheet DS6/VL53L0X_I2C_CLK, sheet DS7/VL53L0X_I2C_CLK, sheet DS8/VL53L0X_I2C_CLK
NetCN7_DS5_4: R24.1 ; port VL53L0X_I2C_SDA, sheet DS5/VL53L0X_I2C_SDA, sheet DS6/VL53L0X_I2C_SDA, sheet DS7/VL53L0X_I2C_SDA, sheet DS8/VL53L0X_I2C_SDA
NetR20_1: R20.1 U10.15(SDA) U11.15(SDA) ; port GPIO_EXP_I2C_SDA
NetR21_1: R21.1 U10.14(SCL) U11.14(SCL) ; port GPIO_EXP_I2C_CLK
NetR26_1: R26.1 U11.13(~{INT}) ; port ~{DS_INT}

Not connected (* = marked no-connect by the designer): U10 13(~{INT})

### Notes on the sheet
- (near R21) Based on the ToF Sensor Datasheet, I2C pull-up resistors have to be close to the MCU.
- Title
- Size:
- Date:
- A4
- Number:
- Revision:
- Sheet
- of
- Designed by:
- File:

### Library data of the parts
C10 C11 = CAP: as C1 on sheet Nucleo; Supplier: Lomex; Reference: 82-13-46; Value: 100nF
R20-R25 = RES: as R3 on sheet LineSensors; Supplier: Lomex; Reference: 81-10-87; Value: 1K
R26 = RES: as R8 on sheet LineSensors; Supplier: Lomex; Reference: 81-10-99; Value: 10K
U10 U11 = TCA9534PWR: I2C/SMBus Interface 100kHz/400kHz 5.5V 16-Pin TSSOP T/R; Manufacturer: Texas Instruments; Number of I/Os: 8; Frequency: 400kHz; Reference: 595-TCA9534PWR; Name: TCA9534PWR 8 Bit I2C I/O Expander; Supplier 1: Mouser; Manufacturer Part Number: TCA9534PWR; RoHS: Yes; Category: Interface ICs; Stock 1: 8871; Pricing 1: 1=1,44000, 10=1,30000, 25=1,23000, 50=1,23000, 100=1,01000, 250=0,94400, 500=0,83400, 1000=0,65900, 2000=0,63600, 10000=0,63600 (USD); Mount: Surface Mount; Case/Package: TSSOP; Number of Pins: 16; Min Operating Temperature: -40°C; Max Operating Temperature: 85°C; Packaging: Tape and Reel; Interface: I2C; Number of Outputs: 8; Lead Free: Lead Free; RoHS Compliant: Yes; ComponentLink1URL: https://datasheet.ciiva.com/48508/tca9534-48508117.pdf?src-supplier=Avnet; ComponentLink1Description: https://datasheet.ciiva.com/48508/tca9534-48508117.pdf?src-supplier=Avnet; Supplier Part Number 1: 595-TCA9534PWR; Supplier: Mouser

## Sheet VL53L1X-SATEL.SchDoc: VL53L1X Satellite Board
size A4; Date: 2022 Fall; Address1: LK Bulls; Address2: Bagoly Zoltan; Address3: Feher Daniel; Address4: G. Varga Gabor; DocumentNumber: 8; Revision: 1.0; SheetNumber: 8; SheetTotal: 14
Used 4 times, as channels U_DistanceSensors/DS1, U_DistanceSensors/DS2, U_DistanceSensors/DS3, U_DistanceSensors/DS4. Parts and nets are listed once, with the designators drawn on the sheet.
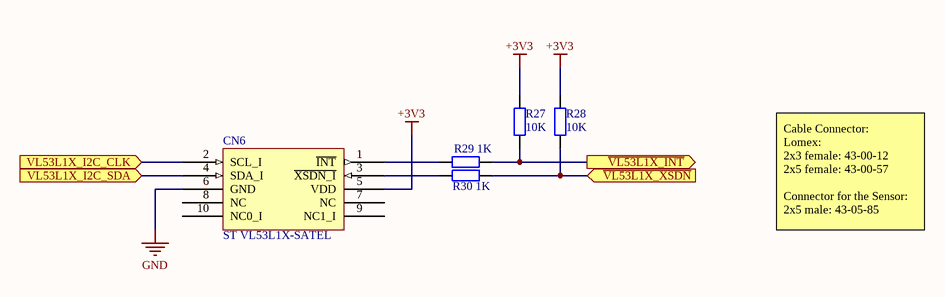
[diagram p7: VL53L1X-SATEL.SchDoc]

### Parts
CN6  ST VL53L1X-SATEL  [FP_DISTANCE_SENSOR]
R27  10K  [FP_0805_RES]
R28  10K  [FP_0805_RES]
R29  1K  [FP_0805_RES]
R30  1K  [FP_0805_RES]

### Ports
VL53L1X_I2C_CLK (in), VL53L1X_I2C_SDA (in), ~{VL53L1X_INT} (out), ~{VL53L1X_XSDN} (in)

### Nets
+3V3: CN6.5(VDD) R27.1 R28.1
GND: CN6.6(GND)
~{VL53L1X_INT}: R27.2 R29.2 ; port ~{VL53L1X_INT}
~{VL53L1X_XSDN}: R28.2 R30.2 ; port ~{VL53L1X_XSDN}
VL53L1X_I2C_CLK: CN6.2(SCL_I) ; port VL53L1X_I2C_CLK
VL53L1X_I2C_SDA: CN6.4(SDA_I) ; port VL53L1X_I2C_SDA
NetCN6_1: CN6.1(~{INT}) R29.1
NetCN6_3: CN6.3(~{XSDN_I}) R30.1

Not connected (* = marked no-connect by the designer): CN6 7(NC) 8(NC) 9(NC1_I) 10(NC0_I)

### Channels
U_DistanceSensors/DS1: designators end in _DS1; ports VL53L1X_I2C_CLK=NetCN6_DS1_2 VL53L1X_I2C_SDA=NetCN6_DS1_4 ~{VL53L1X_INT}=~{DS_INT_1} ~{VL53L1X_XSDN}=~{DS_XSDN_1}
U_DistanceSensors/DS2: designators end in _DS2; ports VL53L1X_I2C_CLK=NetCN6_DS1_2 VL53L1X_I2C_SDA=NetCN6_DS1_4 ~{VL53L1X_INT}=~{DS_INT_2} ~{VL53L1X_XSDN}=~{DS_XSDN_2}
U_DistanceSensors/DS3: designators end in _DS3; ports VL53L1X_I2C_CLK=NetCN6_DS1_2 VL53L1X_I2C_SDA=NetCN6_DS1_4 ~{VL53L1X_INT}=~{DS_INT_3} ~{VL53L1X_XSDN}=~{DS_XSDN_3}
U_DistanceSensors/DS4: designators end in _DS4; ports VL53L1X_I2C_CLK=NetCN6_DS1_2 VL53L1X_I2C_SDA=NetCN6_DS1_4 ~{VL53L1X_INT}=~{DS_INT_4} ~{VL53L1X_XSDN}=~{DS_XSDN_4}

### Notes on the sheet
- Cable Connector:
  Lomex:
  2x3 female: 43-00-12
  2x5 female: 43-00-57
  Connector for the Sensor:
  2x5 male: 43-05-85
- Title
- Size:
- Date:
- A4
- Number:
- Revision:
- Sheet
- of
- Designed by:
- File:

### Library data of the parts
CN6 = ST_53L1-SATEL-I1: 53L1-SATEL-I1 satellite board for ranging sensor (max distance 4m); Name: SZAL.KABEL 6 P APA BH-06 (T-T); Supplier: Lomex; Reference: 43-26-63
R27 R28 = RES: as R8 on sheet LineSensors; Supplier: Lomex; Reference: 81-10-99; Value: 10K
R29 R30 = RES: as R3 on sheet LineSensors; Supplier: Lomex; Reference: 81-10-87; Value: 1K

## Sheet 53L0-SATEL-I1.SchDoc: VL53L0X Satellite Board
size A4; Date: 2022 Fall; Address1: LK Bulls; Address2: Bagoly Zoltan; Address3: Feher Daniel; Address4: G. Varga Gabor; DocumentNumber: 9; Revision: 1.0; SheetNumber: 9; SheetTotal: 14
Used 4 times, as channels U_DistanceSensors/DS5, U_DistanceSensors/DS6, U_DistanceSensors/DS7, U_DistanceSensors/DS8. Parts and nets are listed once, with the designators drawn on the sheet.
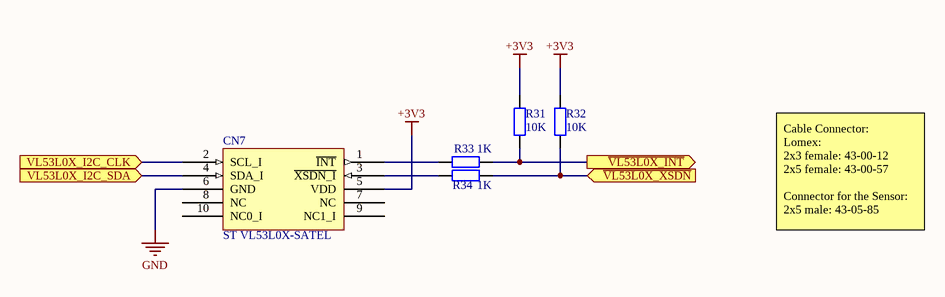
[diagram p8: 53L0-SATEL-I1.SchDoc]

### Parts
CN7  ST VL53L0X-SATEL  [FP_DISTANCE_SENSOR]
R31  10K  [FP_0805_RES]
R32  10K  [FP_0805_RES]
R33  1K  [FP_0805_RES]
R34  1K  [FP_0805_RES]

### Ports
VL53L0X_I2C_CLK (in), VL53L0X_I2C_SDA (in), ~{VL53L0X_INT} (out), ~{VL53L0X_XSDN} (in)

### Nets
+3V3: CN7.5(VDD) R31.1 R32.1
GND: CN7.6(GND)
~{VL53L0X_INT}: R31.2 R33.2 ; port ~{VL53L0X_INT}
~{VL53L0X_XSDN}: R32.2 R34.2 ; port ~{VL53L0X_XSDN}
VL53L0X_I2C_CLK: CN7.2(SCL_I) ; port VL53L0X_I2C_CLK
VL53L0X_I2C_SDA: CN7.4(SDA_I) ; port VL53L0X_I2C_SDA
NetCN7_1: CN7.1(~{INT}) R33.1
NetCN7_3: CN7.3(~{XSDN_I}) R34.1

Not connected (* = marked no-connect by the designer): CN7 7(NC) 8(NC) 9(NC1_I) 10(NC0_I)

### Channels
U_DistanceSensors/DS5: designators end in _DS5; ports VL53L0X_I2C_CLK=NetCN7_DS5_2 VL53L0X_I2C_SDA=NetCN7_DS5_4 ~{VL53L0X_INT}=~{DS_INT_5} ~{VL53L0X_XSDN}=~{DS_XSDN_5}
U_DistanceSensors/DS6: designators end in _DS6; ports VL53L0X_I2C_CLK=NetCN7_DS5_2 VL53L0X_I2C_SDA=NetCN7_DS5_4 ~{VL53L0X_INT}=~{DS_INT_6} ~{VL53L0X_XSDN}=~{DS_XSDN_6}
U_DistanceSensors/DS7: designators end in _DS7; ports VL53L0X_I2C_CLK=NetCN7_DS5_2 VL53L0X_I2C_SDA=NetCN7_DS5_4 ~{VL53L0X_INT}=~{DS_INT_7} ~{VL53L0X_XSDN}=~{DS_XSDN_7}
U_DistanceSensors/DS8: designators end in _DS8; ports VL53L0X_I2C_CLK=NetCN7_DS5_2 VL53L0X_I2C_SDA=NetCN7_DS5_4 ~{VL53L0X_INT}=~{DS_INT_8} ~{VL53L0X_XSDN}=~{DS_XSDN_8}

### Notes on the sheet
- Cable Connector:
  Lomex:
  2x3 female: 43-00-12
  2x5 female: 43-00-57
  Connector for the Sensor:
  2x5 male: 43-05-85
- Title
- Size:
- Date:
- A4
- Number:
- Revision:
- Sheet
- of
- Designed by:
- File:

### Library data of the parts
CN7 = ST_53L0-SATEL-I1: 53L0-SATEL-I1 satellite board for ranging sensor (max distance 2m); Name: SZAL.KABEL 6 P APA BH-06 (T-T); Supplier: Lomex; Reference: 43-26-63
R31 R32 = RES: as R8 on sheet LineSensors; Supplier: Lomex; Reference: 81-10-99; Value: 10K
R33 R34 = RES: as R3 on sheet LineSensors; Supplier: Lomex; Reference: 81-10-87; Value: 1K

## Sheet MotorControl.SchDoc: Motor Control
size A4; Date: 2022 Fall; Address1: LK Bulls; Address2: Bagoly Zoltan; Address3: Feher Daniel; Address4: G. Varga Gabor; DocumentNumber: 10; Revision: 1.0; SheetNumber: 10; SheetTotal: 14
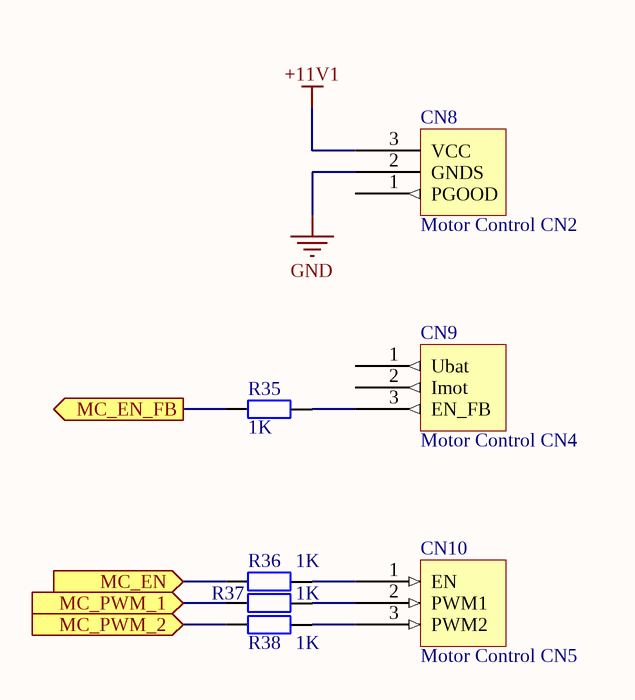
[diagram p9: MotorControl.SchDoc]

### Parts
CN8  Motor Control CN2  [DC_Drive_CN_Stelvio]
CN9  Motor Control CN4  [DC_Drive_CN_Stelvio]
CN10  Motor Control CN5  [DC_Drive_CN_Stelvio]
R35  1K  [FP_0805_RES]
R36  1K  [FP_0805_RES]
R37  1K  [FP_0805_RES]
R38  1K  [FP_0805_RES]

### Ports
MC_EN (in), MC_EN_FB (out), MC_PWM_1 (in), MC_PWM_2 (in)

### Nets
+11V1: CN8.3(VCC)
GND: CN8.2(GNDS)
NetCN9_3: CN9.3(EN_FB) R35.2
NetCN10_1: CN10.1(EN) R36.2
NetCN10_2: CN10.2(PWM1) R37.2
NetCN10_3: CN10.3(PWM2) R38.2
NetR35_1: R35.1 ; port MC_EN_FB
NetR36_1: R36.1 ; port MC_EN
NetR37_1: R37.1 ; port MC_PWM_1
NetR38_1: R38.1 ; port MC_PWM_2

Not connected (* = marked no-connect by the designer): CN8 1(PGOOD); CN9 1(Ubat) 2(Imot)

### Notes on the sheet
- Title
- Size:
- Date:
- A4
- Number:
- Revision:
- Sheet
- of
- Designed by:
- File:

### Library data of the parts
CN8 = Motor_Control_CN2: CN2 connector on the Motor Control PCB; Name: SORKAPOCS 3 P RM3.81 CPP3.81/3 (STE) LIFTES 1mmř 10A; Supplier: Lomex; Reference: 43-09-55
CN9 = Motor_Control_CN4: CN4 connector on the Motor Control PCB; Name: SORKAPOCS 3 P RM3.81 CPP3.81/3 (STE) LIFTES 1mmř 10A; Supplier: Lomex; Reference: 43-09-55
CN10 = Motor_Control_CN5: CN5 connector on the Motor Control PCB; Name: SORKAPOCS 3 P RM3.81 CPP3.81/3 (STE) LIFTES 1mmř 10A; Supplier: Lomex; Reference: 43-09-55
R35-R38 = RES: as R3 on sheet LineSensors; Supplier: Lomex; Reference: 81-10-87; Value: 1K

## Sheet Encoder.SchDoc: Magnetic Encoder
size A4; Date: 2022 Fall; Address1: LK Bulls; Address2: Bagoly Zoltan; Address3: Feher Daniel; Address4: G. Varga Gabor; DocumentNumber: 11; Revision: 1.0; SheetNumber: 11; SheetTotal: 14
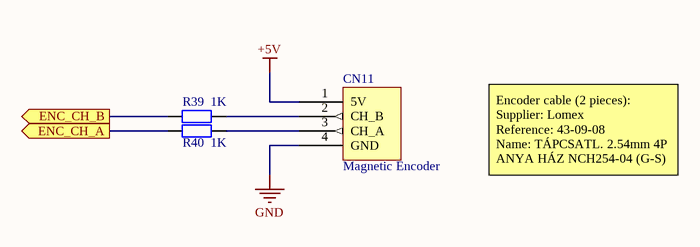
[diagram p10: Encoder.SchDoc]

### Parts
CN11  Magnetic Encoder  [FP_CONN4_TAP_254MM]
R39  1K  [FP_0805_RES]
R40  1K  [FP_0805_RES]

### Ports
ENC_CH_A (out), ENC_CH_B (out)

### Nets
+5V: CN11.1(5V)
GND: CN11.4(GND)
NetCN11_2: CN11.2(CH_B) R39.2
NetCN11_3: CN11.3(CH_A) R40.2
NetR39_1: R39.1 ; port ENC_CH_B
NetR40_1: R40.1 ; port ENC_CH_A

### Notes on the sheet
- Encoder cable (2 pieces):
  Supplier: Lomex
  Reference: 43-09-08
  Name: TÁPCSATL. 2.54mm 4P ANYA HÁZ NCH254-04 (G-S)
- Title
- Size:
- Date:
- A4
- Number:
- Revision:
- Sheet
- of
- Designed by:
- File:

### Library data of the parts
CN11 = Connector_Encoder: Allegro A1333 Magnetic Encoder; Name: TÁPCSATL. 2.54mm 4P APA 180° NCW254-04S (G-S) FORR.; Supplier: Lomex; Reference: 43-08-97
R39 R40 = RES: as R3 on sheet LineSensors; Supplier: Lomex; Reference: 81-10-87; Value: 1K

## Sheet RadioCommunication.SchDoc: Radio Communication
size A4; Date: 2022 Fall; Address1: LK Bulls; Address2: Bagoly Zoltan; Address3: Feher Daniel; Address4: G. Varga Gabor; DocumentNumber: 12; Revision: 1.0; SheetNumber: 12; SheetTotal: 14
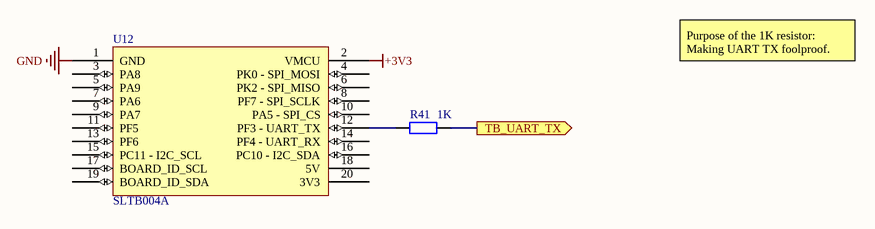
[diagram p11: RadioCommunication.SchDoc]

### Parts
R41  1K  [FP_0805_RES]
U12  SLTB004A  [SLTB004A]

### Ports
TB_UART_TX (out)

### Nets
+3V3: U12.2(VMCU)
GND: U12.1(GND)
NetR41_1: R41.1 U12.12(PF3_-_UART_TX)
NetR41_2: R41.2 ; port TB_UART_TX

Not connected (* = marked no-connect by the designer): U12 3(PA8) 4(PK0_-_SPI_MOSI) 5(PA9) 6(PK2_-_SPI_MISO) 7(PA6) 8(PF7_-_SPI_SCLK) 9(PA7) 10(PA5_-_SPI_CS) 11(PF5) 13(PF6) 14(PF4_-_UART_RX) 15(PC11_-_I2C_SCL) 16(PC10_-_I2C_SDA) 17(BOARD_ID_SCL) 18(5V) 19(BOARD_ID_SDA) 20(3V3)

### Notes on the sheet
- Purpose of the 1K resistor: Making UART TX foolproof.
- Title
- Size:
- Date:
- A4
- Number:
- Revision:
- Sheet
- of
- Designed by:
- File:

### Library data of the parts
R41 = RES: as R3 on sheet LineSensors; Supplier: Lomex; Reference: 81-10-87; Value: 1K
U12 = SLTB004A: SiLabs Thunderboard Sense 2 module; Name: HÜVELY 20 P FHSH-2.54-20 (T-T) 1# h=8,5mm AU; Supplier: Lomex; Reference: 43-00-08

## Sheet Bluetooth.SchDoc: Bluetooth Communication
size A4; Date: 2022 Fall; Address1: LK Bulls; Address2: Bagoly Zoltan; Address3: Feher Daniel; Address4: G. Varga Gabor; DocumentNumber: 13; Revision: 1.0; SheetNumber: 13; SheetTotal: 14
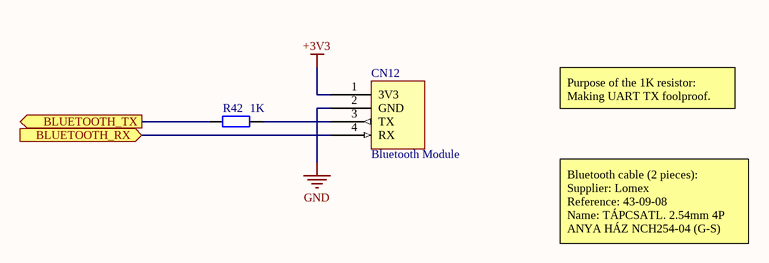
[diagram p12: Bluetooth.SchDoc]

### Parts
CN12  Bluetooth Module  [FP_CONN4_TAP_254MM]
R42  1K  [FP_0805_RES]

### Ports
BLUETOOTH_RX (in), BLUETOOTH_TX (out)

### Nets
+3V3: CN12.1(3V3)
GND: CN12.2(GND)
NetCN12_3: CN12.3(TX) R42.2
NetCN12_4: CN12.4(RX) ; port BLUETOOTH_RX
NetR42_1: R42.1 ; port BLUETOOTH_TX

### Notes on the sheet
- Purpose of the 1K resistor: Making UART TX foolproof.
- Bluetooth cable (2 pieces):
  Supplier: Lomex
  Reference: 43-09-08
  Name: TÁPCSATL. 2.54mm 4P ANYA HÁZ NCH254-04 (G-S)
- Title
- Size:
- Date:
- A4
- Number:
- Revision:
- Sheet
- of
- Designed by:
- File:

### Library data of the parts
CN12 = Connector_HC-05: HC-05 tokozva, kérdés, hogy melyik lábon vannak valójában a dolgok; reference1: 100.416.39 (gombbal); reference2: 100.355.62 (gomb nélkül); reference3: 100.355.65 (master-slave); Name: HC-05 bluetooth modul 4P, master-slave, gombbal; Supplier: Hestore; Reference: 43-08-97
R42 = RES: as R3 on sheet LineSensors; Supplier: Lomex; Reference: 81-10-87; Value: 1K

## Sheet IMU.SchDoc: Inertial Measurement Unit
size A4; Date: 2022 Fall; Address1: LK Bulls; Address2: Bagoly Zoltan; Address3: Feher Daniel; Address4: G. Varga Gabor; DocumentNumber: 14; Revision: 1.0; SheetNumber: 14; SheetTotal: 14
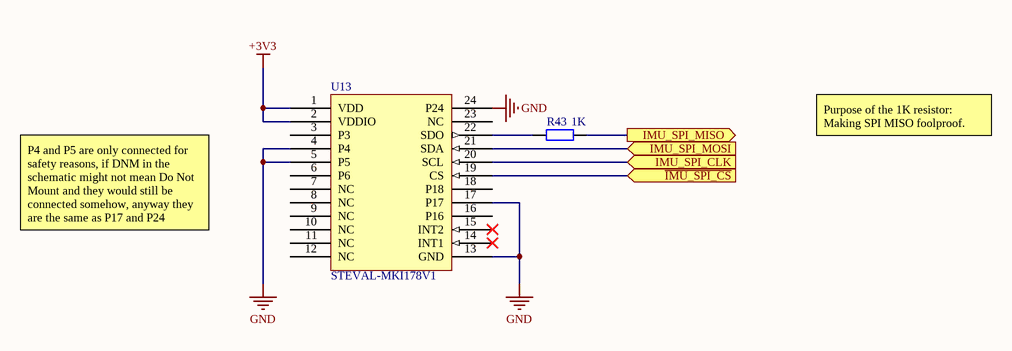
[diagram p13: IMU.SchDoc]

### Parts
R43  1K  [FP_0805_RES]
U13  STEVAL-MKI178V1  [FP_STEVAL_IMU]

### Ports
IMU_SPI_CLK (in), IMU_SPI_MISO (out), IMU_SPI_MOSI (in), ~{IMU_SPI_CS} (in)

### Nets
+3V3: U13.1(VDD) U13.2(VDDIO)
GND: U13.4(P4) U13.5(P5) U13.13(GND) U13.17(P17) U13.24(P24)
NetR43_1: R43.1 U13.22(SDO)
NetR43_2: R43.2 ; port IMU_SPI_MISO
NetU1_1: U13.20(SCL) ; port IMU_SPI_CLK
NetU1_17: U13.19(CS) ; port ~{IMU_SPI_CS}
NetU1_34: U13.21(SDA) ; port IMU_SPI_MOSI

Not connected (* = marked no-connect by the designer): U13 3(P3) 6(P6) 7(NC) 8(NC) 9(NC) 10(NC) 11(NC) 12(NC) 14(INT1)* 15(INT2)* 16(P16) 18(P18) 23(NC)

### Notes on the sheet
- Purpose of the 1K resistor: Making SPI MISO foolproof.
- P4 and P5 are only connected for safety reasons, if DNM in the schematic might not mean Do Not Mount and they would still be connected somehow, anyway they are the same as P17 and P24
- Title
- Size:
- Date:
- A4
- Number:
- Revision:
- Sheet
- of
- Designed by:
- File:

### Library data of the parts
R43 = RES: as R3 on sheet LineSensors; Supplier: Lomex; Reference: 81-10-87; Value: 1K
U13 = STEVAL-MKI178V1: Adapter board for LSM6DS3H 3D digital accelerometer and 3D digital gyroscope , SPI/I2C interface; Name: HÜVELY 40 P FHSH-2.54-40 (T-T) 1# h=8,5mm AU; Supplier: Lomex; Reference: 43-03-71

## Nets that join several sheets
+3V3: Nucleo (R1.2 U1.16), LineSensors (8 pins), Displays (7 pins), DistanceSensors (14 pins), U_DistanceSensors/DS1 (CN6_DS1.5 R27_DS1.1 R28_DS1.1), U_DistanceSensors/DS2 (CN6_DS2.5 R27_DS2.1 R28_DS2.1), U_DistanceSensors/DS3 (CN6_DS3.5 R27_DS3.1 R28_DS3.1), U_DistanceSensors/DS4 (CN6_DS4.5 R27_DS4.1 R28_DS4.1), U_DistanceSensors/DS5 (CN7_DS5.5 R31_DS5.1 R32_DS5.1), U_DistanceSensors/DS6 (CN7_DS6.5 R31_DS6.1 R32_DS6.1), U_DistanceSensors/DS7 (CN7_DS7.5 R31_DS7.1 R32_DS7.1), U_DistanceSensors/DS8 (CN7_DS8.5 R31_DS8.1 R32_DS8.1), RadioCommunication (U12.2), Bluetooth (CN12.1), IMU (U13.1 U13.2)
+5V: Nucleo (U1.6), Displays (6 pins), Power (C7.2 R14.2 U7.7 U7.8), Encoder (CN11.1)
+6V_S1: Power (C8.2 R16.2 U8.7 U8.8), Servos (CN4.2)
+6V_S2: Power (C9.2 R17.2 U9.7 U9.8), Servos (CN5.2)
+11V1: LineSensors (CN1.2 CN1.4 CN2.2 CN2.4), Power (7 pins), MotorControl (CN8.3)
GND: Nucleo (10 pins), LineSensors (14 pins), Displays (9 pins), Power (21 pins), Servos (CN4.3 CN5.3), DistanceSensors (7 pins), U_DistanceSensors/DS1 (CN6_DS1.6), U_DistanceSensors/DS2 (CN6_DS2.6), U_DistanceSensors/DS3 (CN6_DS3.6), U_DistanceSensors/DS4 (CN6_DS4.6), U_DistanceSensors/DS5 (CN7_DS5.6), U_DistanceSensors/DS6 (CN7_DS6.6), U_DistanceSensors/DS7 (CN7_DS7.6), U_DistanceSensors/DS8 (CN7_DS8.6), MotorControl (CN8.2), Encoder (CN11.4), RadioCommunication (U12.1), Bluetooth (CN12.2), IMU (5 pins)
~{DS_INT_1}: DistanceSensors (U11.4), U_DistanceSensors/DS1 (R27_DS1.2 R29_DS1.2)
~{DS_INT_2}: DistanceSensors (U11.5), U_DistanceSensors/DS2 (R27_DS2.2 R29_DS2.2)
~{DS_INT_3}: DistanceSensors (U11.6), U_DistanceSensors/DS3 (R27_DS3.2 R29_DS3.2)
~{DS_INT_4}: DistanceSensors (U11.7), U_DistanceSensors/DS4 (R27_DS4.2 R29_DS4.2)
~{DS_INT_5}: DistanceSensors (U11.9), U_DistanceSensors/DS5 (R31_DS5.2 R33_DS5.2)
~{DS_INT_6}: DistanceSensors (U11.10), U_DistanceSensors/DS6 (R31_DS6.2 R33_DS6.2)
~{DS_INT_7}: DistanceSensors (U11.11), U_DistanceSensors/DS7 (R31_DS7.2 R33_DS7.2)
~{DS_INT_8}: DistanceSensors (U11.12), U_DistanceSensors/DS8 (R31_DS8.2 R33_DS8.2)
~{DS_XSDN_1}: DistanceSensors (U10.4), U_DistanceSensors/DS1 (R28_DS1.2 R30_DS1.2)
~{DS_XSDN_2}: DistanceSensors (U10.5), U_DistanceSensors/DS2 (R28_DS2.2 R30_DS2.2)
~{DS_XSDN_3}: DistanceSensors (U10.6), U_DistanceSensors/DS3 (R28_DS3.2 R30_DS3.2)
~{DS_XSDN_4}: DistanceSensors (U10.7), U_DistanceSensors/DS4 (R28_DS4.2 R30_DS4.2)
~{DS_XSDN_5}: DistanceSensors (U10.9), U_DistanceSensors/DS5 (R32_DS5.2 R34_DS5.2)
~{DS_XSDN_6}: DistanceSensors (U10.10), U_DistanceSensors/DS6 (R32_DS6.2 R34_DS6.2)
~{DS_XSDN_7}: DistanceSensors (U10.11), U_DistanceSensors/DS7 (R32_DS7.2 R34_DS7.2)
~{DS_XSDN_8}: DistanceSensors (U10.12), U_DistanceSensors/DS8 (R32_DS8.2 R34_DS8.2)
NetCN6_DS1_2: Nucleo (U1.61), DistanceSensors (R23.1), U_DistanceSensors/DS1 (CN6_DS1.2), U_DistanceSensors/DS2 (CN6_DS2.2), U_DistanceSensors/DS3 (CN6_DS3.2), U_DistanceSensors/DS4 (CN6_DS4.2)
NetCN6_DS1_4: Nucleo (U1.39), DistanceSensors (R22.1), U_DistanceSensors/DS1 (CN6_DS1.4), U_DistanceSensors/DS2 (CN6_DS2.4), U_DistanceSensors/DS3 (CN6_DS3.4), U_DistanceSensors/DS4 (CN6_DS4.4)
NetCN7_DS5_2: Nucleo (U1.63), DistanceSensors (R25.1), U_DistanceSensors/DS5 (CN7_DS5.2), U_DistanceSensors/DS6 (CN7_DS6.2), U_DistanceSensors/DS7 (CN7_DS7.2), U_DistanceSensors/DS8 (CN7_DS8.2)
NetCN7_DS5_4: Nucleo (U1.3), DistanceSensors (R24.1), U_DistanceSensors/DS5 (CN7_DS5.4), U_DistanceSensors/DS6 (CN7_DS6.4), U_DistanceSensors/DS7 (CN7_DS7.4), U_DistanceSensors/DS8 (CN7_DS8.4)
NetCN12_4: Nucleo (U1.28), Bluetooth (CN12.4)
NetR3_2: Nucleo (U1.36), LineSensors (R3.2)
NetR4_2: Nucleo (U1.68), LineSensors (R4.2)
NetR5_2: Nucleo (U1.53), LineSensors (R5.2)
NetR6_2: Nucleo (U1.51), LineSensors (R6.2)
NetR7_2: Nucleo (U1.49), LineSensors (R7.2)
NetR8_1: Nucleo (U1.60), LineSensors (R8.1 U2.13)
NetR9_1: Nucleo (U1.44), LineSensors (R9.1 U3.13)
NetR10_1: Nucleo (U1.38), Displays (R10.1 U4.13 U5.13 U6.13)
NetR18_1: Nucleo (U1.64), Servos (R18.1)
NetR19_1: Nucleo (U1.66), Servos (R19.1)
NetR20_1: Nucleo (U1.43), DistanceSensors (R20.1 U10.15 U11.15)
NetR21_1: Nucleo (U1.41), DistanceSensors (R21.1 U10.14 U11.14)
NetR26_1: Nucleo (U1.67), DistanceSensors (R26.1 U11.13)
NetR35_1: Nucleo (U1.4), MotorControl (R35.1)
NetR36_1: Nucleo (U1.54), MotorControl (R36.1)
NetR37_1: Nucleo (U1.40), MotorControl (R37.1)
NetR38_1: Nucleo (U1.57), MotorControl (R38.1)
NetR39_1: Nucleo (U1.21), Encoder (R39.1)
NetR40_1: Nucleo (U1.55), Encoder (R40.1)
NetR41_2: Nucleo (U1.71), RadioCommunication (R41.2)
NetR42_1: Nucleo (U1.2), Bluetooth (R42.1)
NetR43_2: Nucleo (U1.65), IMU (R43.2)
NetU1_1: Nucleo (U1.1), IMU (U13.20)
NetU1_17: Nucleo (U1.17), IMU (U13.19)
NetU1_30: Nucleo (U1.30), Displays (U4.2)
NetU1_34: Nucleo (U1.34), IMU (U13.21)
NetU1_35: Nucleo (U1.35), Displays (U4.4 U5.4 U6.4)
NetU1_37: Nucleo (U1.37), Displays (U4.3 U5.3 U6.3)
NetU1_62: Nucleo (U1.62), LineSensors (U3.12)
NetU1_72: Nucleo (U1.72), LineSensors (U2.12)